# Altium project STM32G4_DRV8301_hardware.PrjPcb (part 1 of 5)
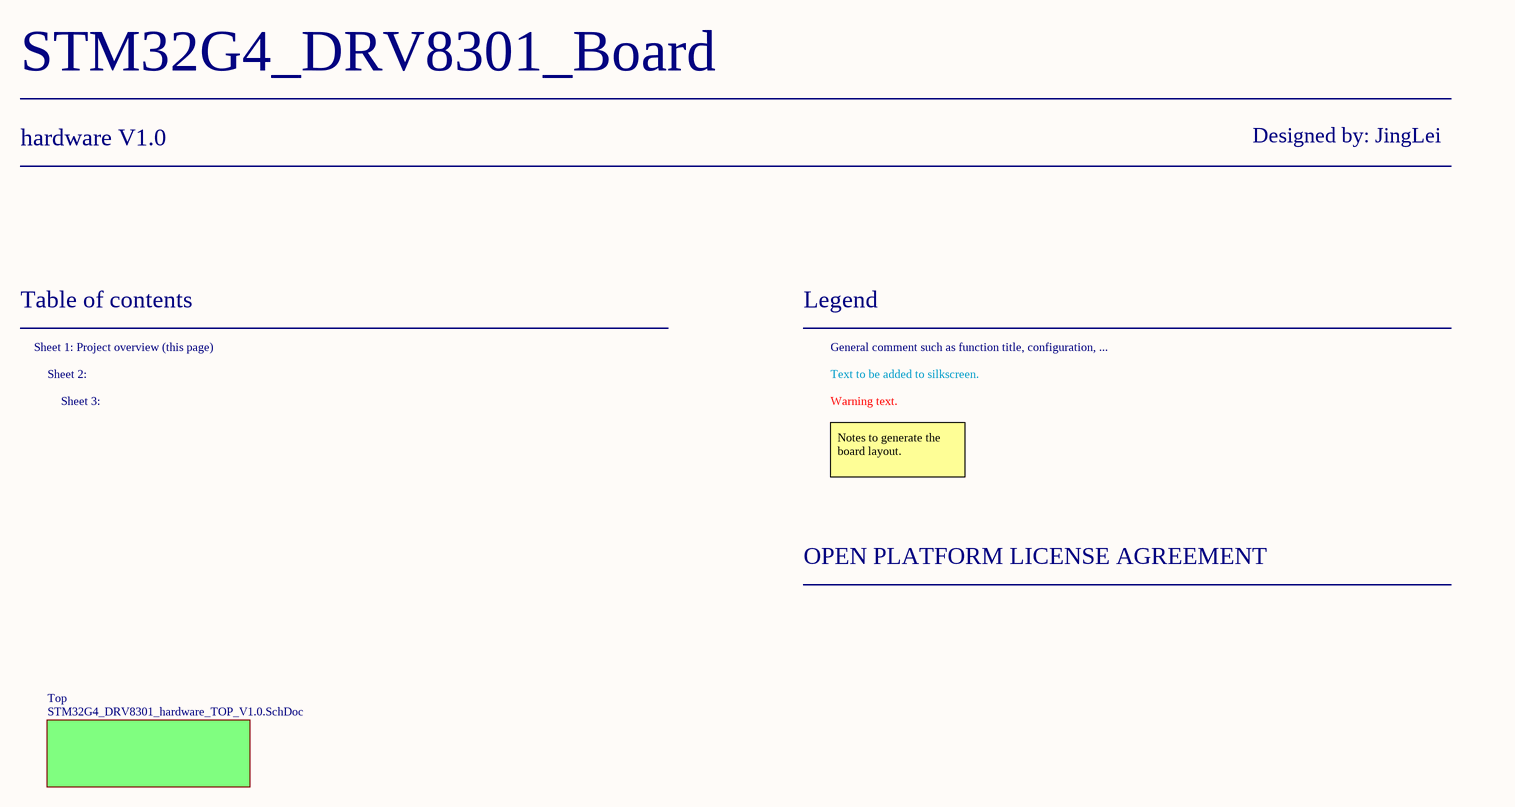
[diagram p0: Project_overview.SchDoc]
9 sheets, 368 parts. Net scope: flat (ports and power ports of the same name join across sheets).
Board file: STM32G4_DRV8301_hardware.PcbDoc
Sheets:
  Project_overview.SchDoc
    Top = STM32G4_DRV8301_hardware_TOP_V1.0.SchDoc
      Designator = STM32G4_microcontroller.SchDoc
      Designator = STM32G4_microcontroller_Power.SchDoc
      Designator = M1_DRV8301_driver.SchDoc
      Designator = DRV8301_inverter.SchDoc
      Designator = STM32F1_microcontroller.SchDoc
      Designator = DRV8301_SENSE.SchDoc
      Designator = M2_DRV8301_driver.SchDoc

## Sheet Project_overview.SchDoc
size 420 x 297 mm; SheetNumber: 1; SheetTotal: 8

### Sub-sheets
Top = STM32G4_DRV8301_hardware_TOP_V1.0.SchDoc: no entries

### Notes on the sheet
- STM32G4_DRV8301_Board
- hardware V1.0
- Designed by: JingLei
- Table of contents
- Sheet 1: Project overview (this page)
- Legend
- General comment such as function title, configuration, ...
- Sheet 2:
- Sheet 3:
- Text to be added to silkscreen.
- Warning text.
- Notes to generate the board layout.
- OPEN PLATFORM LICENSE AGREEMENT
- THIS DOCUMENT AND THE DATA DISCLOSED HEREIN OR
- HEREWITH IS THE PROPERTY OF ALTIUM LIMITED AND MAY
- DWG NO:
- REVISION
- REV:
- DESCRIPTION
- DATE
- APPROVED
- BE FREELY DISTRIBUTED IN WHOLE. NO RIGHTS ARE
- RESERVED OR EXPRESS OR IMPLIED WARANTEE GIVEN.
- ENG:
- APPROVALS
- PROJECT
- DSN:
- CHK:
- REFERENCE DOCUMENTS
- PROJECT REVISION:
- TITLE
- DOCUMENT REVISION:
- DESIGN ITEM:
- BOM:
- FAB DWG:
- PCB DWG:
- ASSY DWG:
- SCALE:
- A3
- SIZE
- CAGE CODE
- FILE NAME
- DWG NO.
- SHEET
- OF
- REV

## Sheet STM32G4_DRV8301_hardware_TOP_V1.0.SchDoc
size 420 x 297 mm; SheetNumber: 2; SheetTotal: 9
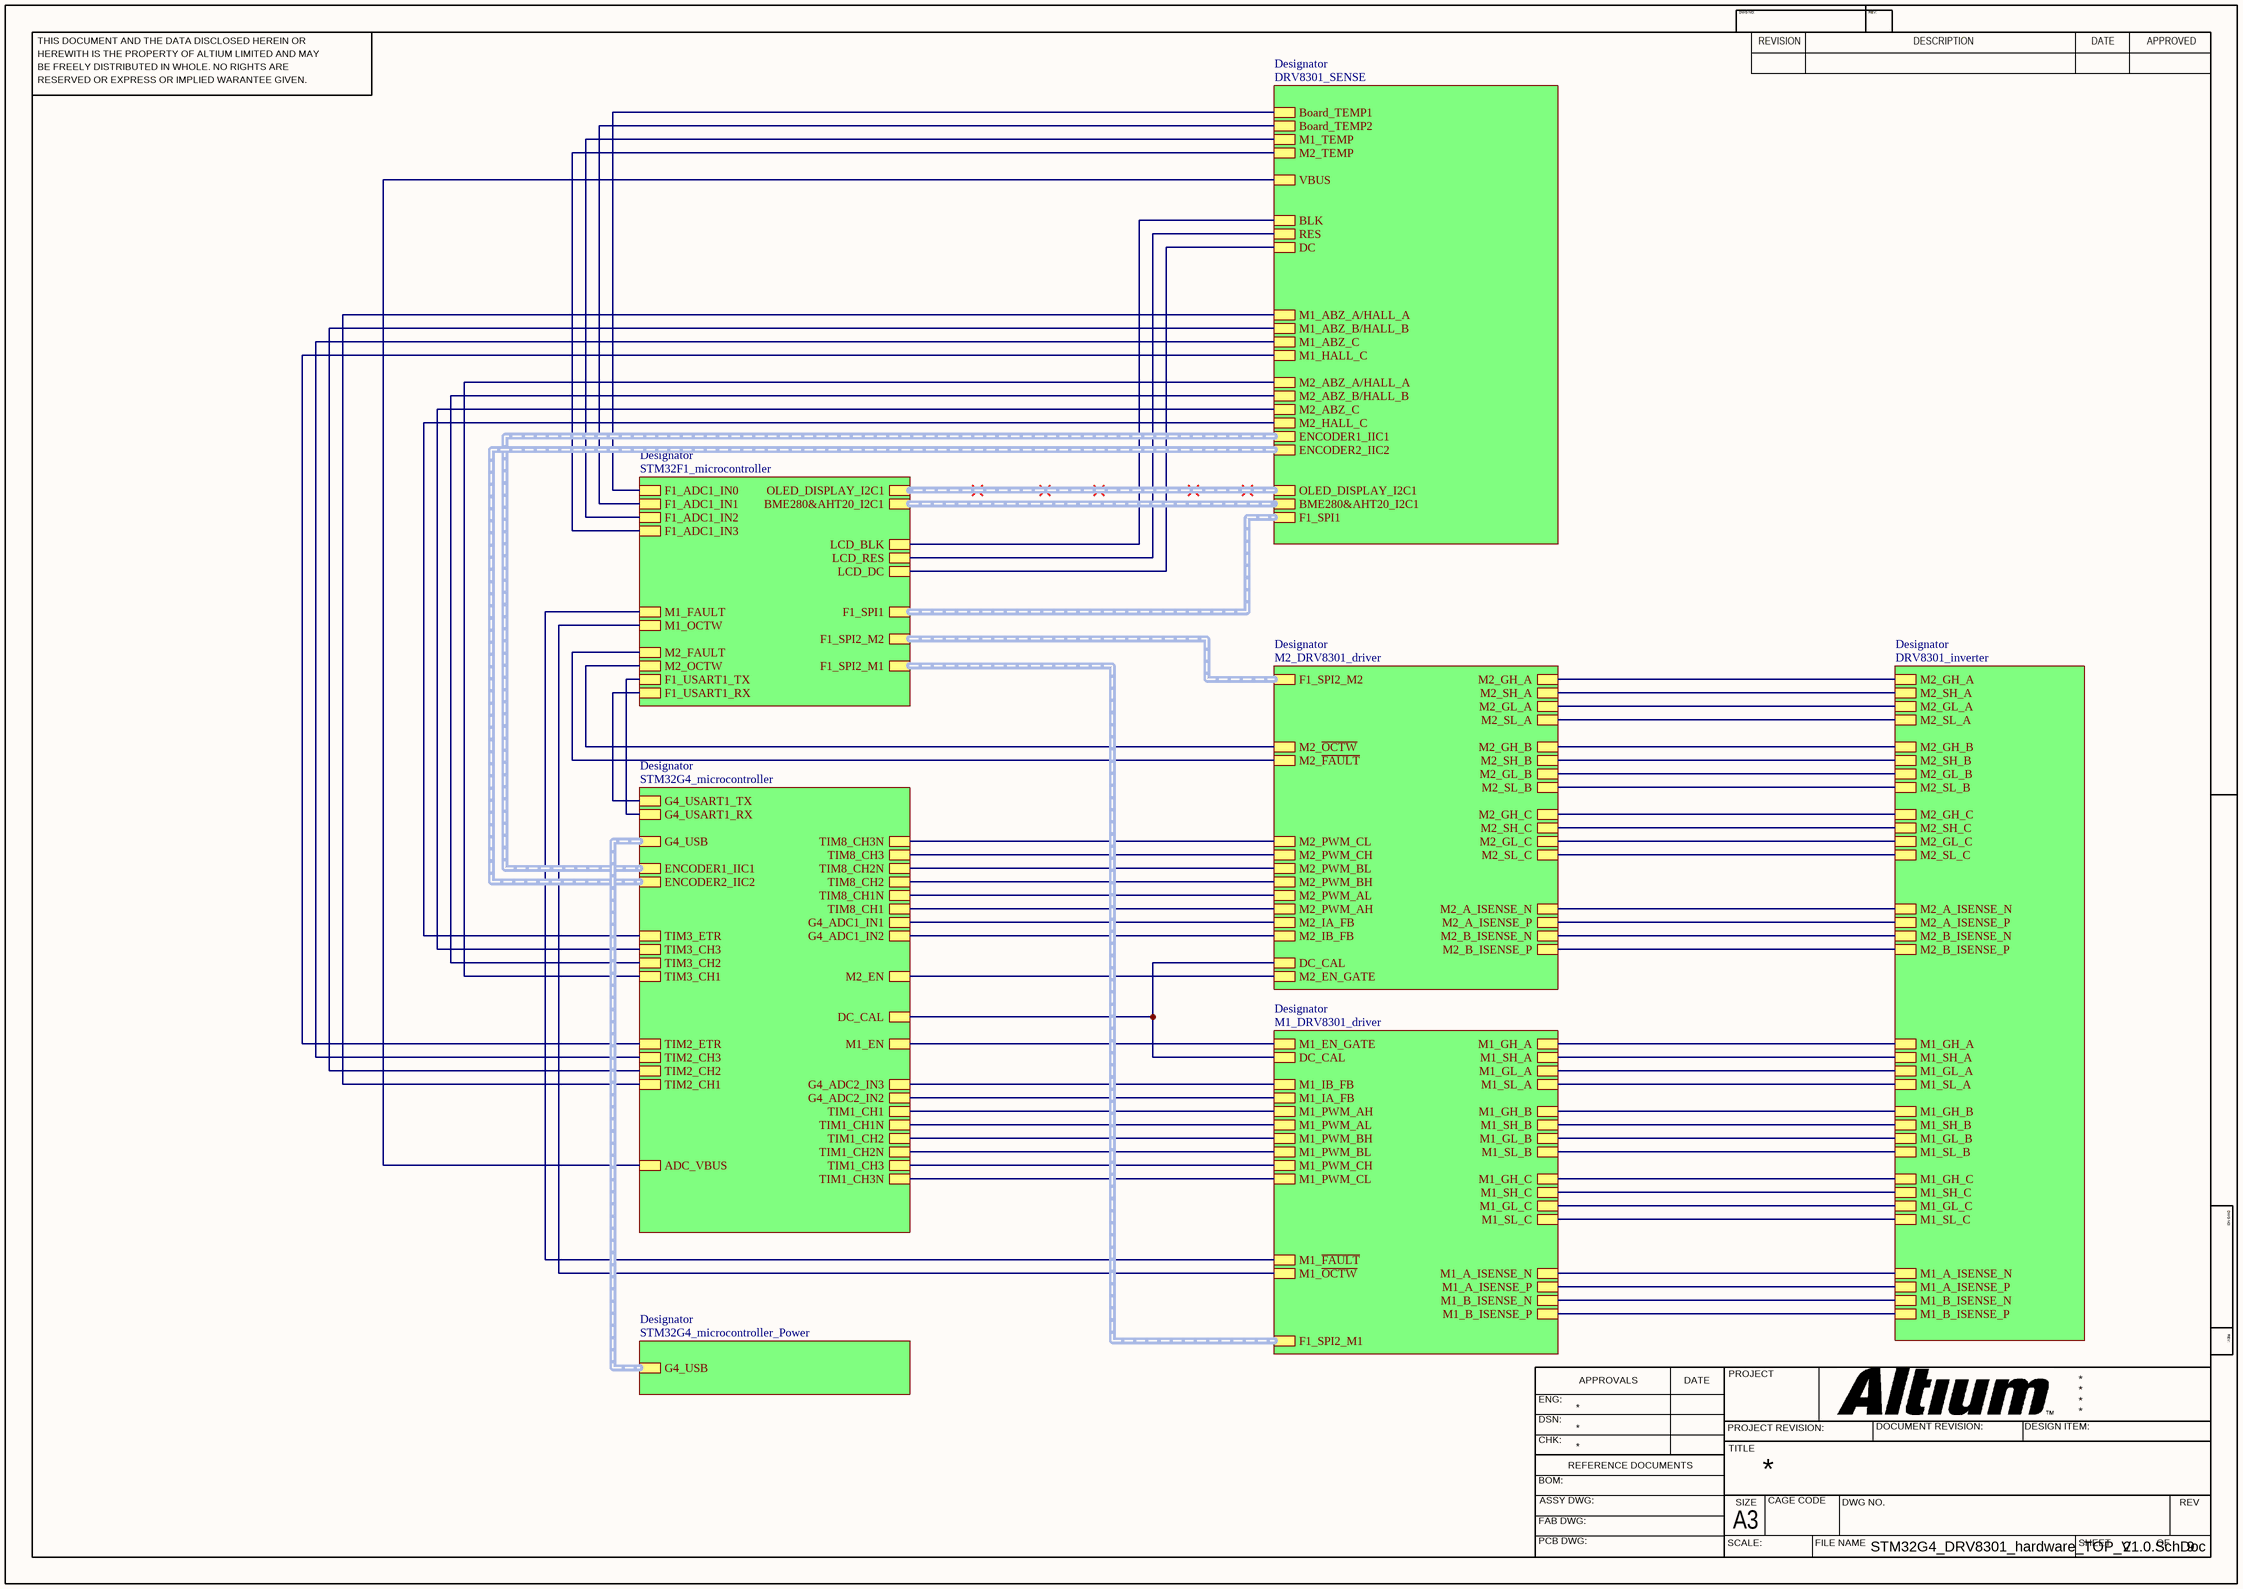
[diagram p1: STM32G4_DRV8301_hardware_TOP_V1.0.SchDoc]

### Sub-sheets
Designator = STM32G4_microcontroller: G4_ADC1_IN1, G4_ADC1_IN2, TIM3_CH2, G4_ADC2_IN3, M2_EN, ADC_VBUS, G4_ADC2_IN2, TIM3_CH1, TIM3_ETR, ENCODER2_IIC2 (harness ENCODER2_IIC2), G4_USB (harness G4_USB), ENCODER1_IIC1 (harness ENCODER1_IIC1), DC_CAL, M1_EN, TIM1_CH1, TIM1_CH2, TIM1_CH3, TIM1_CH1N, TIM1_CH2N, TIM1_CH3N, TIM8_CH1, TIM8_CH2, TIM8_CH3, TIM8_CH1N, TIM8_CH2N, TIM8_CH3N, TIM3_CH3, TIM2_ETR, TIM2_CH1, TIM2_CH2, TIM2_CH3, G4_USART1_TX, G4_USART1_RX
Designator = STM32G4_microcontroller_Power: G4_USB (harness G4_USB)
Designator = M1_DRV8301_driver: M1_PWM_AL, M1_PWM_AH, M1_PWM_BH, M1_PWM_CH, M1_PWM_BL, M1_PWM_CL, M1_~{OCTW}, M1_~{FAULT}, M1_IA_FB, M1_EN_GATE, M1_IB_FB, M1_GH_A, M1_SH_A, M1_GL_A, M1_SL_A, M1_GH_B, M1_SH_B, M1_GL_B, M1_SL_B, M1_GH_C, M1_SH_C, M1_GL_C, M1_SL_C, M1_A_ISENSE_N, M1_A_ISENSE_P, M1_B_ISENSE_N, M1_B_ISENSE_P, DC_CAL, F1_SPI2_M1 (harness F1_SPI2_M1)
Designator = DRV8301_inverter: M2_GH_A, M2_SH_A, M2_GL_A, M2_SL_A, M2_GH_B, M2_SH_B, M2_GL_B, M2_SL_B, M2_GH_C, M2_SH_C, M2_GL_C, M2_SL_C, M2_A_ISENSE_N, M2_A_ISENSE_P, M2_B_ISENSE_N, M2_B_ISENSE_P, M1_GH_A, M1_SH_A, M1_GL_A, M1_SL_A, M1_GH_B, M1_SH_B, M1_GL_B, M1_SL_B, M1_GH_C, M1_SH_C, M1_GL_C, M1_SL_C, M1_A_ISENSE_N, M1_A_ISENSE_P, M1_B_ISENSE_N, M1_B_ISENSE_P
Designator = STM32F1_microcontroller: F1_ADC1_IN0, M2_FAULT, M2_OCTW, M1_FAULT, M1_OCTW, BME280&AHT20_I2C1 (harness BME280&AHT20_I2C1), OLED_DISPLAY_I2C1 (harness OLED_DISPLAY_I2C1), F1_ADC1_IN1, F1_ADC1_IN2, F1_ADC1_IN3, F1_SPI1 (harness F1_SPI1), F1_SPI2_M1 (harness F1_SPI2_M1), F1_SPI2_M2 (harness F1_SPI2_M2), LCD_BLK, LCD_RES, LCD_DC, F1_USART1_TX, F1_USART1_RX
Designator = DRV8301_SENSE: Board_TEMP1, Board_TEMP2, M1_TEMP, M2_TEMP, BLK, DC, RES, OLED_DISPLAY_I2C1 (harness OLED_DISPLAY_I2C1), BME280&AHT20_I2C1 (harness BME280&AHT20_I2C1), F1_SPI1 (harness F1_SPI1), ENCODER2_IIC2 (harness ENCODER2_IIC2), ENCODER1_IIC1 (harness ENCODER1_IIC1), M1_ABZ_A/HALL_A, M1_ABZ_B/HALL_B, M1_HALL_C, M1_ABZ_C, M2_ABZ_A/HALL_A, M2_ABZ_B/HALL_B, M2_HALL_C, M2_ABZ_C, VBUS
Designator = M2_DRV8301_driver: M2_PWM_AL, M2_PWM_AH, M2_PWM_BH, M2_PWM_CH, M2_PWM_BL, M2_PWM_CL, M2_~{OCTW}, M2_~{FAULT}, M2_IA_FB, M2_EN_GATE, M2_IB_FB, M2_GH_A, M2_SH_A, M2_GL_A, M2_SL_A, M2_GH_B, M2_SH_B, M2_GL_B, M2_SL_B, M2_GH_C, M2_SH_C, M2_GL_C, M2_SL_C, M2_A_ISENSE_N, M2_A_ISENSE_P, M2_B_ISENSE_N, M2_B_ISENSE_P, DC_CAL, F1_SPI2_M2 (harness F1_SPI2_M2)

### Nets
(unnamed): sheet Designator/G4_ADC1_IN1, sheet Designator/M2_IA_FB
(unnamed): sheet Designator/G4_ADC1_IN2, sheet Designator/M2_IB_FB
(unnamed): sheet Designator/TIM3_CH2, sheet Designator/M2_ABZ_B/HALL_B
(unnamed): sheet Designator/G4_ADC2_IN3, sheet Designator/M1_IB_FB
(unnamed): sheet Designator/M2_EN, sheet Designator/M2_EN_GATE
(unnamed): sheet Designator/ADC_VBUS, sheet Designator/VBUS
(unnamed): sheet Designator/G4_ADC2_IN2, sheet Designator/M1_IA_FB
(unnamed): sheet Designator/TIM3_CH1, sheet Designator/M2_ABZ_A/HALL_A
(unnamed): sheet Designator/TIM3_ETR, sheet Designator/M2_HALL_C
(unnamed): sheet Designator/DC_CAL, sheet Designator/DC_CAL, sheet Designator/DC_CAL
(unnamed): sheet Designator/M1_EN, sheet Designator/M1_EN_GATE
(unnamed): sheet Designator/TIM1_CH1, sheet Designator/M1_PWM_AH
(unnamed): sheet Designator/TIM1_CH2, sheet Designator/M1_PWM_BH
(unnamed): sheet Designator/TIM1_CH3, sheet Designator/M1_PWM_CH
(unnamed): sheet Designator/TIM1_CH1N, sheet Designator/M1_PWM_AL
(unnamed): sheet Designator/TIM1_CH2N, sheet Designator/M1_PWM_BL
(unnamed): sheet Designator/TIM1_CH3N, sheet Designator/M1_PWM_CL
(unnamed): sheet Designator/TIM8_CH1, sheet Designator/M2_PWM_AH
(unnamed): sheet Designator/TIM8_CH2, sheet Designator/M2_PWM_BH
(unnamed): sheet Designator/TIM8_CH3, sheet Designator/M2_PWM_CH
(unnamed): sheet Designator/TIM8_CH1N, sheet Designator/M2_PWM_AL
(unnamed): sheet Designator/TIM8_CH2N, sheet Designator/M2_PWM_BL
(unnamed): sheet Designator/TIM8_CH3N, sheet Designator/M2_PWM_CL
(unnamed): sheet Designator/TIM3_CH3, sheet Designator/M2_ABZ_C
(unnamed): sheet Designator/TIM2_ETR, sheet Designator/M1_HALL_C
(unnamed): sheet Designator/TIM2_CH1, sheet Designator/M1_ABZ_A/HALL_A
(unnamed): sheet Designator/TIM2_CH2, sheet Designator/M1_ABZ_B/HALL_B
(unnamed): sheet Designator/TIM2_CH3, sheet Designator/M1_ABZ_C
(unnamed): sheet Designator/G4_USART1_TX, sheet Designator/F1_USART1_RX
(unnamed): sheet Designator/G4_USART1_RX, sheet Designator/F1_USART1_TX
(unnamed): sheet Designator/M1_~{OCTW}, sheet Designator/M1_OCTW
(unnamed): sheet Designator/M1_~{FAULT}, sheet Designator/M1_FAULT
(unnamed): sheet Designator/M1_GH_A, sheet Designator/M1_GH_A
(unnamed): sheet Designator/M1_SH_A, sheet Designator/M1_SH_A
(unnamed): sheet Designator/M1_GL_A, sheet Designator/M1_GL_A
(unnamed): sheet Designator/M1_SL_A, sheet Designator/M1_SL_A
(unnamed): sheet Designator/M1_GH_B, sheet Designator/M1_GH_B
(unnamed): sheet Designator/M1_SH_B, sheet Designator/M1_SH_B
(unnamed): sheet Designator/M1_GL_B, sheet Designator/M1_GL_B
(unnamed): sheet Designator/M1_SL_B, sheet Designator/M1_SL_B
(unnamed): sheet Designator/M1_GH_C, sheet Designator/M1_GH_C
(unnamed): sheet Designator/M1_SH_C, sheet Designator/M1_SH_C
(unnamed): sheet Designator/M1_GL_C, sheet Designator/M1_GL_C
(unnamed): sheet Designator/M1_SL_C, sheet Designator/M1_SL_C
(unnamed): sheet Designator/M1_A_ISENSE_N, sheet Designator/M1_A_ISENSE_N
(unnamed): sheet Designator/M1_A_ISENSE_P, sheet Designator/M1_A_ISENSE_P
(unnamed): sheet Designator/M1_B_ISENSE_N, sheet Designator/M1_B_ISENSE_N
(unnamed): sheet Designator/M1_B_ISENSE_P, sheet Designator/M1_B_ISENSE_P
(unnamed): sheet Designator/M2_GH_A, sheet Designator/M2_GH_A
(unnamed): sheet Designator/M2_SH_A, sheet Designator/M2_SH_A
(unnamed): sheet Designator/M2_GL_A, sheet Designator/M2_GL_A
(unnamed): sheet Designator/M2_SL_A, sheet Designator/M2_SL_A
(unnamed): sheet Designator/M2_GH_B, sheet Designator/M2_GH_B
(unnamed): sheet Designator/M2_SH_B, sheet Designator/M2_SH_B
(unnamed): sheet Designator/M2_GL_B, sheet Designator/M2_GL_B
(unnamed): sheet Designator/M2_SL_B, sheet Designator/M2_SL_B
(unnamed): sheet Designator/M2_GH_C, sheet Designator/M2_GH_C
(unnamed): sheet Designator/M2_SH_C, sheet Designator/M2_SH_C
(unnamed): sheet Designator/M2_GL_C, sheet Designator/M2_GL_C
(unnamed): sheet Designator/M2_SL_C, sheet Designator/M2_SL_C
(unnamed): sheet Designator/M2_A_ISENSE_N, sheet Designator/M2_A_ISENSE_N
(unnamed): sheet Designator/M2_A_ISENSE_P, sheet Designator/M2_A_ISENSE_P
(unnamed): sheet Designator/M2_B_ISENSE_N, sheet Designator/M2_B_ISENSE_N
(unnamed): sheet Designator/M2_B_ISENSE_P, sheet Designator/M2_B_ISENSE_P
(unnamed): sheet Designator/F1_ADC1_IN0, sheet Designator/Board_TEMP1
(unnamed): sheet Designator/M2_FAULT, sheet Designator/M2_~{FAULT}
(unnamed): sheet Designator/M2_OCTW, sheet Designator/M2_~{OCTW}
(unnamed): sheet Designator/F1_ADC1_IN1, sheet Designator/Board_TEMP2
(unnamed): sheet Designator/F1_ADC1_IN2, sheet Designator/M1_TEMP
(unnamed): sheet Designator/F1_ADC1_IN3, sheet Designator/M2_TEMP
(unnamed): sheet Designator/LCD_BLK, sheet Designator/BLK
(unnamed): sheet Designator/LCD_RES, sheet Designator/RES
(unnamed): sheet Designator/LCD_DC, sheet Designator/DC

### Notes on the sheet
- THIS DOCUMENT AND THE DATA DISCLOSED HEREIN OR
- HEREWITH IS THE PROPERTY OF ALTIUM LIMITED AND MAY
- DWG NO:
- REVISION
- REV:
- DESCRIPTION
- DATE
- APPROVED
- BE FREELY DISTRIBUTED IN WHOLE. NO RIGHTS ARE
- RESERVED OR EXPRESS OR IMPLIED WARANTEE GIVEN.
- ENG:
- APPROVALS
- PROJECT
- DSN:
- CHK:
- REFERENCE DOCUMENTS
- PROJECT REVISION:
- TITLE
- DOCUMENT REVISION:
- DESIGN ITEM:
- BOM:
- FAB DWG:
- PCB DWG:
- ASSY DWG:
- SCALE:
- A3
- SIZE
- CAGE CODE
- FILE NAME
- DWG NO.
- SHEET
- OF
- REV

## Sheet STM32G4_microcontroller.SchDoc
size 420 x 297 mm; SheetNumber: 3; SheetTotal: 9
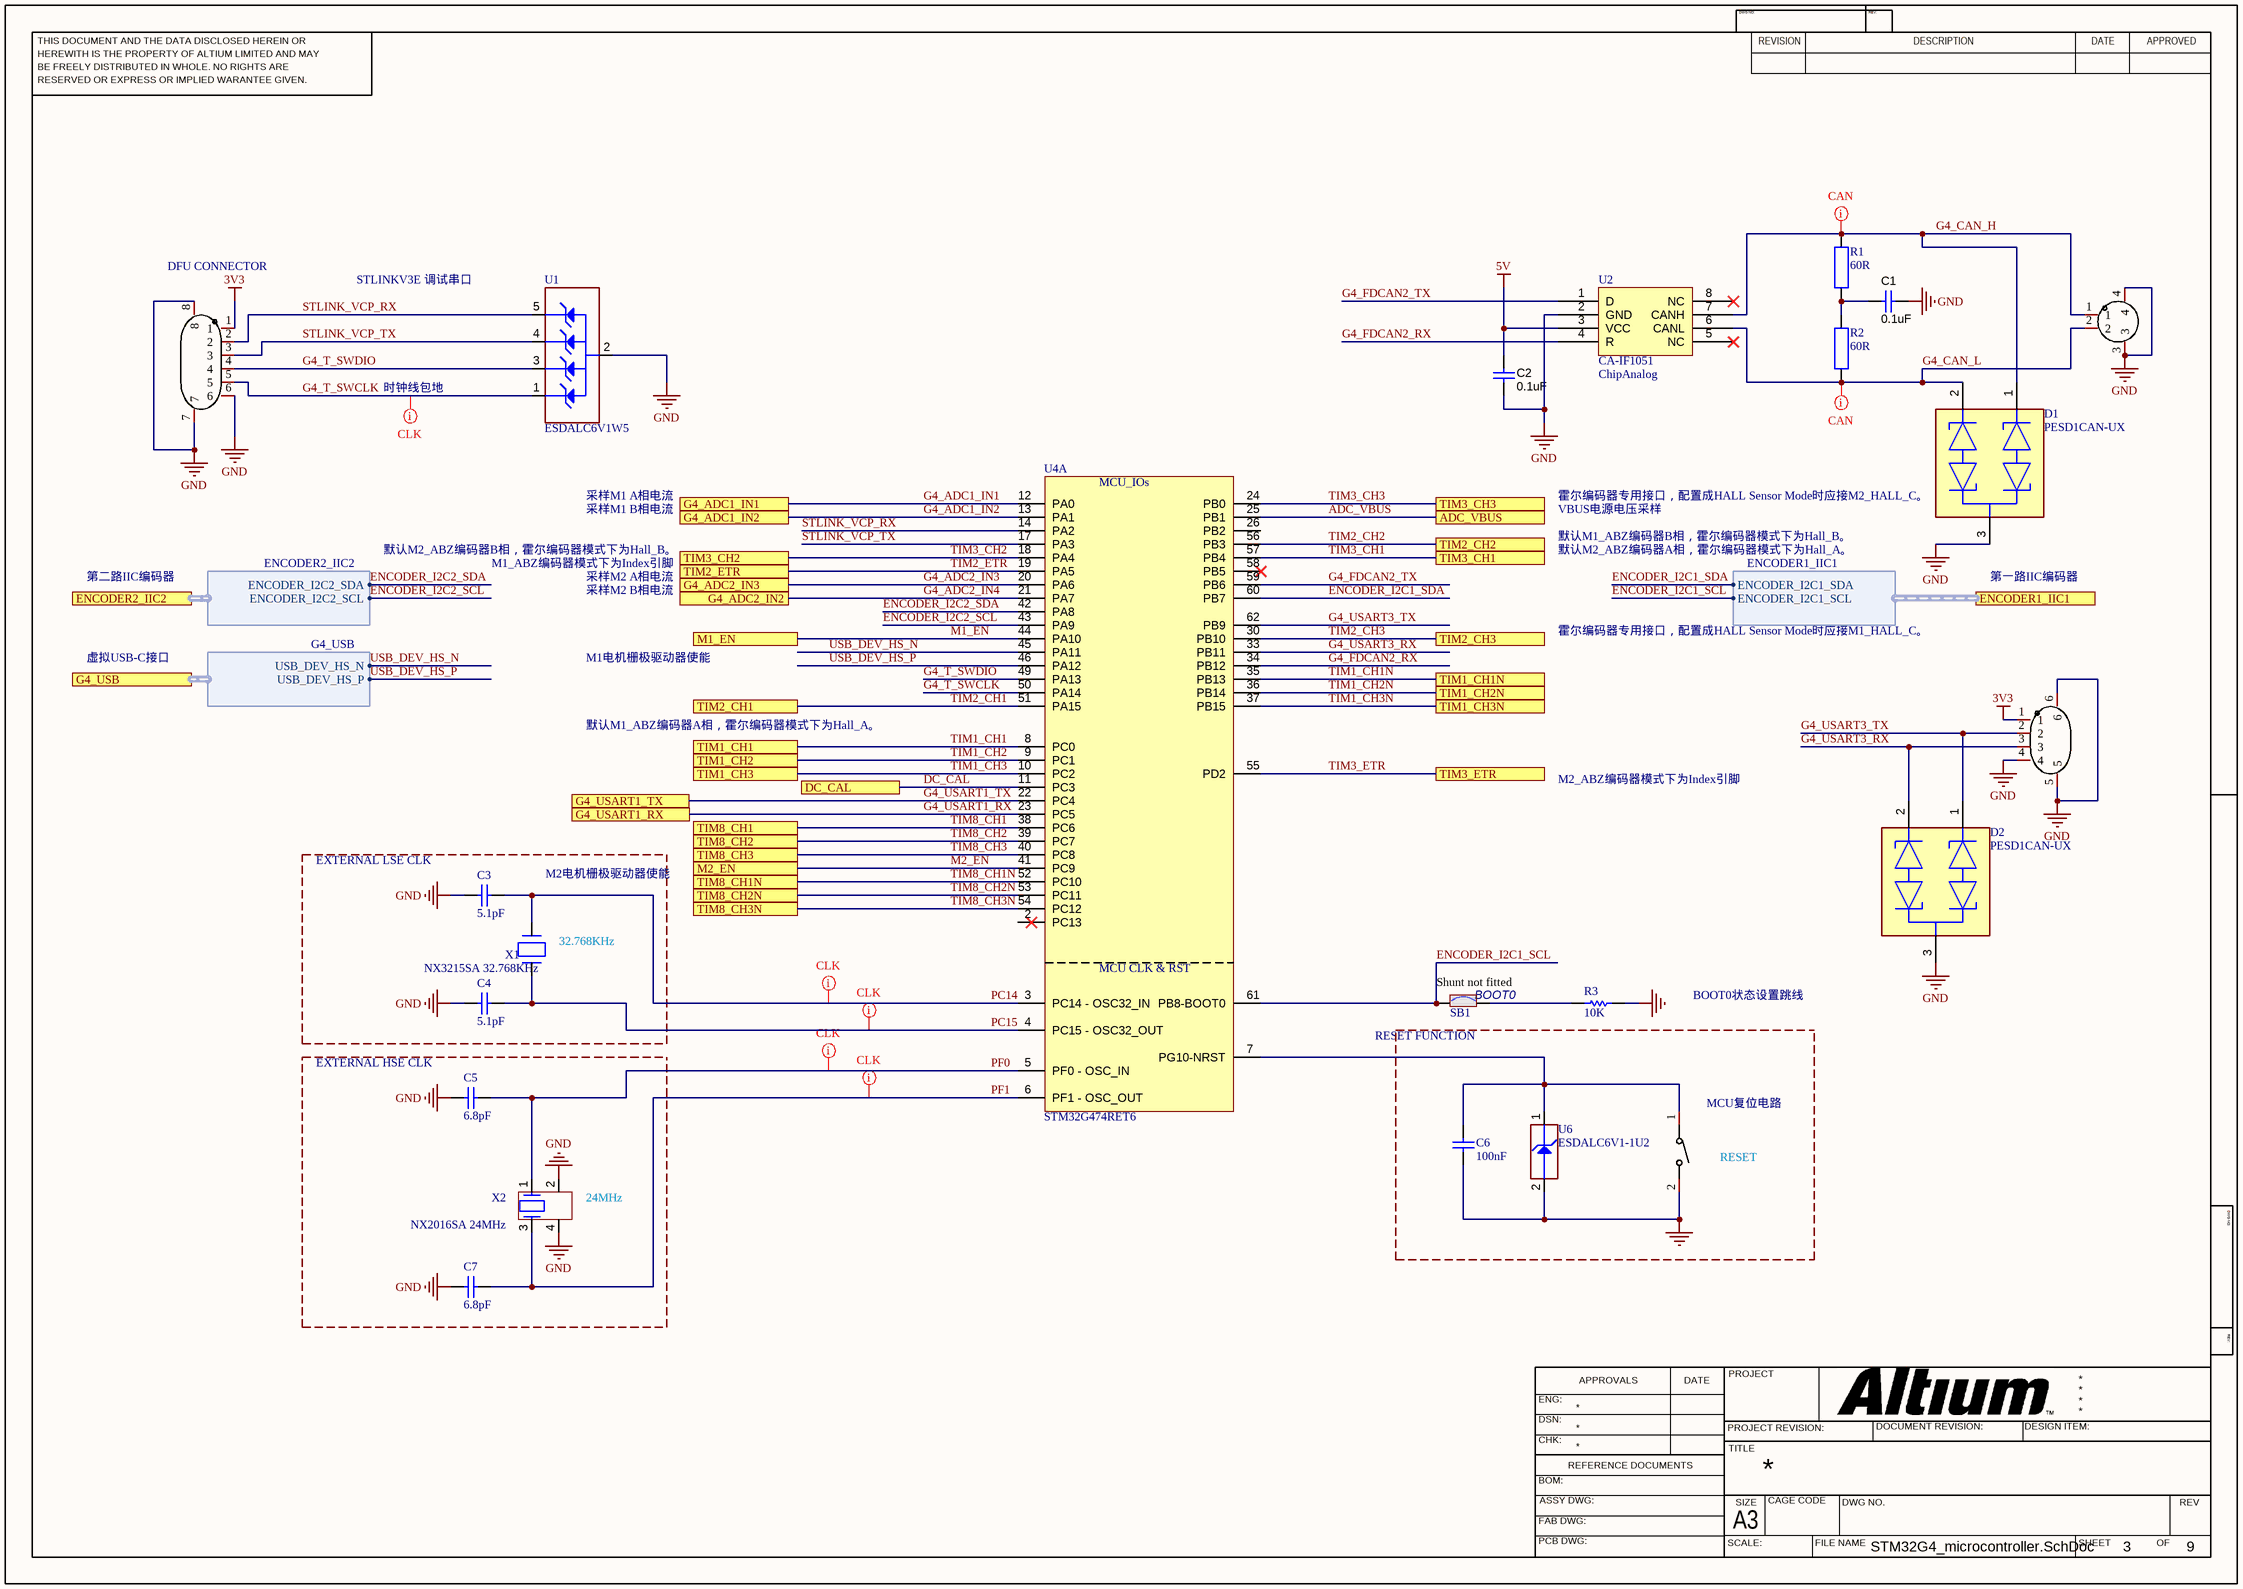
[diagram p2: STM32G4_microcontroller.SchDoc]

### Parts
C1  ValueDisplayed: 0.1uF  [0603L]  (hidden comment: GRM188R61E105KA12D)
C2  ValueDisplayed: 0.1uF  [0603L]  (hidden comment: GRM188R61E105KA12D)
C3  value 5.1pF  [C0402]
C4  value 5.1pF  [C0402]
C5  value 6.8pF  [C0402]
C6  value 100nF  [C0402]
C7  value 6.8pF  [C0402]
CN1  WAFER-GH1.25-2PWB  [CONN-TH_2P-P1.25_XUNPU_WAFER-GH1.25-2PWB]  (value not drawn)
D1  PESD1CAN-UX  [FP-SOT323-MFG]
D2  PESD1CAN-UX  [FP-SOT323-MFG]
R1  60R  [RESC1608X55N]
R2  60R  [RESC1608X55N]
R3  value 10K  [R0603]
SB1  MCD-00071  [SOLDER-BRIDGE_R0603-0R]  (value not drawn)
SW1  TS-1088-AR02016  [SW-SMD_L3.9-W3.0-P4.45]  (value not drawn)
U1  value ESDALC6V1W5  [ESD_SOT323-5L]
U2  CA-IF1051  [SOIC127P600X175-8N]
U3  WAFER-GH1.25-6PWB  [CONN-SMD_6P-P1.25_XUNPU_WAFER-GH1.25-6PWB]  (value not drawn)
U4  value STM32G474RET6  [ICC_LQFP64_10X10_P050_SOCKET_YAMAICHI_IC149-064-069-B5_NM]  (part A of 2)
U5  WAFER-GH1.25-4PWB  [CONN-SMD_4P-P1.25_XUNPU_WAFER-GH1.25-4PWB]  (value not drawn)
U6  value ESDALC6V1-1U2  [ESD_ST0201]
X1  value NX3215SA 32.768KHz  [CRY_NX3215SA_2P]
X2  value NX2016SA 24MHz  [CRY_NX2016SA_4P]

### Ports
ADC_VBUS (see STM32G4_DRV8301_hardware_TOP_V1.0[2C]), DC_CAL (see STM32G4_DRV8301_hardware_TOP_V1.0[3C], M1_DRV8301_driver[7D], M2_DRV8301_driver[8D]), ENCODER1_IIC1 (harness ENCODER1_IIC1, see STM32G4_DRV8301_hardware_TOP_V1.0[2C], DRV8301_SENSE[3E]), ENCODER2_IIC2 (harness ENCODER2_IIC2, see STM32G4_DRV8301_hardware_TOP_V1.0[2C], DRV8301_SENSE[3E]), G4_ADC1_IN1 (see STM32G4_DRV8301_hardware_TOP_V1.0[3C]), G4_ADC1_IN2 (see STM32G4_DRV8301_hardware_TOP_V1.0[3C]), G4_ADC2_IN2 (see STM32G4_DRV8301_hardware_TOP_V1.0[3C]), G4_ADC2_IN3 (see STM32G4_DRV8301_hardware_TOP_V1.0[3C]), G4_USART1_RX (see STM32G4_DRV8301_hardware_TOP_V1.0[2C]), G4_USART1_TX (see STM32G4_DRV8301_hardware_TOP_V1.0[2C]), G4_USB (harness G4_USB, see STM32G4_DRV8301_hardware_TOP_V1.0[2C], STM32G4_microcontroller_Power[3D]), M1_EN (see STM32G4_DRV8301_hardware_TOP_V1.0[3C]), M2_EN (see STM32G4_DRV8301_hardware_TOP_V1.0[3C]), TIM1_CH1 (see STM32G4_DRV8301_hardware_TOP_V1.0[3C]), TIM1_CH1N (see STM32G4_DRV8301_hardware_TOP_V1.0[3C]), TIM1_CH2 (see STM32G4_DRV8301_hardware_TOP_V1.0[3C]), TIM1_CH2N (see STM32G4_DRV8301_hardware_TOP_V1.0[3C]), TIM1_CH3 (see STM32G4_DRV8301_hardware_TOP_V1.0[3C]), TIM1_CH3N (see STM32G4_DRV8301_hardware_TOP_V1.0[3C]), TIM2_CH1 (see STM32G4_DRV8301_hardware_TOP_V1.0[2C]), TIM2_CH2 (see STM32G4_DRV8301_hardware_TOP_V1.0[2C]), TIM2_CH3 (see STM32G4_DRV8301_hardware_TOP_V1.0[2C]), TIM2_ETR (see STM32G4_DRV8301_hardware_TOP_V1.0[2C]), TIM3_CH1 (see STM32G4_DRV8301_hardware_TOP_V1.0[2C]), TIM3_CH2 (see STM32G4_DRV8301_hardware_TOP_V1.0[2C]), TIM3_CH3 (see STM32G4_DRV8301_hardware_TOP_V1.0[2C]), TIM3_ETR (see STM32G4_DRV8301_hardware_TOP_V1.0[2C]), TIM8_CH1 (see STM32G4_DRV8301_hardware_TOP_V1.0[3C]), TIM8_CH1N (see STM32G4_DRV8301_hardware_TOP_V1.0[3C]), TIM8_CH2 (see STM32G4_DRV8301_hardware_TOP_V1.0[3C]), TIM8_CH2N (see STM32G4_DRV8301_hardware_TOP_V1.0[3C]), TIM8_CH3 (see STM32G4_DRV8301_hardware_TOP_V1.0[3C]), TIM8_CH3N (see STM32G4_DRV8301_hardware_TOP_V1.0[3C])

### Harnesses
ENCODER2_IIC2: ENCODER_I2C2_SDA, ENCODER_I2C2_SCL
G4_USB: USB_DEV_HS_N, USB_DEV_HS_P
ENCODER1_IIC1: ENCODER_I2C1_SDA, ENCODER_I2C1_SCL

### Nets
3V3: U3.1 U5.1
5V: C2.1 U2.3(VCC)
GND: C1.2 C2.2 C3.2 C4.2 C5.1 C6.1 C7.1 CN1.3 CN1.4 D1.3(common_cathode) D2.3(common_cathode) R3.1 SW1.2 U1.2(GND) U2.2(GND) U3.6 U3.7 U3.8 U5.4 U5.5 U5.6 U6.2(GND) X2.2 X2.4
ADC_VBUS: U4.25(PB1) ; port ADC_VBUS
DC_CAL: U4.11(PC3) ; port DC_CAL
ENCODER_I2C1_SCL: SB1.1 U4.61(PB8-BOOT0) ; port ENCODER1_IIC1.ENCODER_I2C1_SCL
ENCODER_I2C1_SDA: U4.60(PB7) ; port ENCODER1_IIC1.ENCODER_I2C1_SDA
ENCODER_I2C2_SCL: U4.43(PA9) ; port ENCODER2_IIC2.ENCODER_I2C2_SCL
ENCODER_I2C2_SDA: U4.42(PA8) ; port ENCODER2_IIC2.ENCODER_I2C2_SDA
G4_ADC1_IN1: U4.12(PA0) ; port G4_ADC1_IN1
G4_ADC1_IN2: U4.13(PA1) ; port G4_ADC1_IN2
G4_ADC2_IN3: U4.20(PA6) ; port G4_ADC2_IN3
G4_ADC2_IN4: U4.21(PA7) ; port G4_ADC2_IN2
G4_CAN_H: CN1.1 D1.1(cathode_1) R1.2 U2.7(CANH)
G4_CAN_L: CN1.2 D1.2(cathode_2) R2.1 U2.6(CANL)
G4_FDCAN2_RX: U2.4(R) U4.34(PB12)
G4_FDCAN2_TX: U2.1(D) U4.59(PB6)
G4_T_SWCLK: U1.1(IO1) U3.5 U4.50(PA14)
G4_T_SWDIO: U1.3(IO2) U3.4 U4.49(PA13)
G4_USART1_RX: U4.23(PC5) ; port G4_USART1_RX
G4_USART1_TX: U4.22(PC4) ; port G4_USART1_TX
G4_USART3_RX: D2.2(cathode_2) U4.33(PB11) U5.3
G4_USART3_TX: D2.1(cathode_1) U4.62(PB9) U5.2
M1_EN: U4.44(PA10) ; port M1_EN
M2_EN: U4.41(PC9) ; port M2_EN
PC14: C3.1 U4.3(PC14_-_OSC32_IN) X1.2(X2)
PC15: C4.1 U4.4(PC15_-_OSC32_OUT) X1.1(X1)
PF0: C5.2 U4.5(PF0_-_OSC_IN) X2.1
PF1: C7.2 U4.6(PF1_-_OSC_OUT) X2.3
STLINK_VCP_RX: U1.5(IO4) U3.2 U4.14(PA2)
STLINK_VCP_TX: U1.4(IO3) U3.3 U4.17(PA3)
TIM1_CH1: U4.8(PC0) ; port TIM1_CH1
TIM1_CH1N: U4.35(PB13) ; port TIM1_CH1N
TIM1_CH2: U4.9(PC1) ; port TIM1_CH2
TIM1_CH2N: U4.36(PB14) ; port TIM1_CH2N
TIM1_CH3: U4.10(PC2) ; port TIM1_CH3
TIM1_CH3N: U4.37(PB15) ; port TIM1_CH3N
TIM2_CH1: U4.51(PA15) ; port TIM2_CH1
TIM2_CH2: U4.56(PB3) ; port TIM2_CH2
TIM2_CH3: U4.30(PB10) ; port TIM2_CH3
TIM2_ETR: U4.19(PA5) ; port TIM2_ETR
TIM3_CH1: U4.57(PB4) ; port TIM3_CH1
TIM3_CH2: U4.18(PA4) ; port TIM3_CH2
TIM3_CH3: U4.24(PB0) ; port TIM3_CH3
TIM3_ETR: U4.55(PD2) ; port TIM3_ETR
TIM8_CH1: U4.38(PC6) ; port TIM8_CH1
TIM8_CH1N: U4.52(PC10) ; port TIM8_CH1N
TIM8_CH2: U4.39(PC7) ; port TIM8_CH2
TIM8_CH2N: U4.53(PC11) ; port TIM8_CH2N
TIM8_CH3: U4.40(PC8) ; port TIM8_CH3
TIM8_CH3N: U4.54(PC12) ; port TIM8_CH3N
USB_DEV_HS_N: U4.45(PA11) ; port G4_USB.USB_DEV_HS_N
USB_DEV_HS_P: U4.46(PA12) ; port G4_USB.USB_DEV_HS_P
NetC1_1: C1.1 R1.1 R2.2
NetC6_2: C6.2 SW1.1 U4.7(PG10-NRST) U6.1(IO1)
NetR3_2: R3.2 SB1.2

Not connected (* = marked no-connect by the designer): U2 5(NC)* 8(NC)*; U4 2(PC13) 26(PB2) 58(PB5)*

### Layout directives
mark named CAN: G4_CAN_H, G4_CAN_L
mark named CLK: G4_T_SWCLK, PC14, PC15, PF0, PF1

### Notes on the sheet
- (near U3) DFU CONNECTOR
- STLINKV3E 调试串口
- 时钟线包地
- (near U2) ChipAnalog
- 采样M1 A相电流
- 采样M1 B相电流
- VBUS电源电压采样
- 霍尔编码器专用接口，配置成HALL Sensor Mode时应接M2_HALL_C。
- 第二路IIC编码器
- 默认M2_ABZ编码器B相，霍尔编码器模式下为Hall_B。
- M1_ABZ编码器模式下为Index引脚
- 采样M2 A相电流
- 采样M2 B相电流
- 默认M1_ABZ编码器B相，霍尔编码器模式下为Hall_B。
- 默认M2_ABZ编码器A相，霍尔编码器模式下为Hall_A。
- 第一路IIC编码器
- 虚拟USB-C接口
- M1电机栅极驱动器使能
- 霍尔编码器专用接口，配置成HALL Sensor Mode时应接M1_HALL_C。
- 默认M1_ABZ编码器A相，霍尔编码器模式下为Hall_A。
- M2_ABZ编码器模式下为Index引脚
- EXTERNAL LSE CLK
- M2电机栅极驱动器使能
- (near X1) 32.768KHz
- (near SB1) Shunt not fitted
- BOOT0
- BOOT0状态设置跳线
- EXTERNAL HSE CLK
- RESET FUNCTION
- (near SW1) MCU复位电路
- (near X2) 24MHz
- (near SW1) RESET
- THIS DOCUMENT AND THE DATA DISCLOSED HEREIN OR
- HEREWITH IS THE PROPERTY OF ALTIUM LIMITED AND MAY
- DWG NO:
- REVISION
- REV:
- DESCRIPTION
- DATE
- APPROVED
- BE FREELY DISTRIBUTED IN WHOLE. NO RIGHTS ARE
- RESERVED OR EXPRESS OR IMPLIED WARANTEE GIVEN.
- ENG:
- APPROVALS
- PROJECT
- DSN:
- CHK:
- REFERENCE DOCUMENTS
- PROJECT REVISION:
- TITLE
- DOCUMENT REVISION:
- DESIGN ITEM:
- BOM:
- FAB DWG:
- PCB DWG:
- ASSY DWG:
- SCALE:
- A3
- SIZE
- CAGE CODE
- FILE NAME
- DWG NO.
- SHEET
- OF
- REV
- (in symbol MCD-01243, part A) MCU_IOs; MCU CLK & RST

### Library data of the parts
C1 C2 = GRM188R61E105KA12D: CAP, CERM, 0.1uF, 25V, +/-10%, X5R, 0603; Manufacturer: MuRata; Polarized: N; CompType: Capacitor; Value: 1uF; U/M: EA; Cap_F: 0.000001; Tolerance_%: 10; Value1: Unknown; VDC_V: 25; TaMin_C: -55; TaMax_C: 85; Cap_Case: 0603; SymbolVersion: 2008-07-09; PartNumber: GRM188R61E105KA12D; PackageReference: 0603; RoHS: Y; Value2: 25V; MountType: SMT; Technology: Ceramic; TempCo: X5R; Published: 2008-06-19; Publisher: Texas Instruments; LatestRevisionDate: 2013-05-24; LatestRevisionNote: Changed publisher; ComponentLink1Description: Datasheet link; ComponentLink1URL: http://search.murata.co.jp/Ceramy/PnsearchViewAction.do?HnOFG=ON&HnNFG=ON&SEL_CNT=50&sLang=en&sKey=GRM188R61E105KA12D&x=9&y=9&search=startwith; Supplier 1: Digi-Key; Supplier Part Number 1: 490-3897-1-ND; Supplier 2: Mouser; Supplier Part Number 2: 81-GRM188R61E105KA12; Supplier 3: Farnell; Supplier Part Number 3: 1828802
C3 C4 = MCD-00003: Capacitor, MLCC, 5.1pF, 50V, NPO, +-0.25pF, 0402, T=0.5mm; Manufacturer_Part_Number: CC0402CRNPO9BN5R1; Manufacturer: YAGEO; ECCN_US: EAR99; ECCN_EU: NEC; Provided_By: SUBCO; Internal_Part_Number: MCD-00003; ComponentLink1Description: Datasheet; Status: Released; Part_Type: Capacitor; Package: C0402; ComponentLink1URL: http://tunmcdsvn.tun.st.com/Component_Datasheet_Library/Trunk/Capacitors/Yageo_Capacitor_NP0_16V-to-50V
C5 C7 = MCD-00674: Capacitor, MLCC, 6.8pF, 50V, NPO, +-0.25pF, 0402, T=0.5mm; Manufacturer_Part_Number: CC0402CRNPO9BN6R8; Manufacturer: YAGEO; Provided_By: SUBCO; Internal_Part_Number: MCD-00674; Status: Released; Part_Type: Capacitor; Package: C0402; ComponentLink1Description: Datasheet; ComponentLink1URL: http://tunmcdsvn.tun.st.com/Component_Datasheet_Library/Trunk/Capacitors/Yageo_Capacitor_NP0_16V-to-50V; ECCN_US: N/A; ECCN_EU: N/A
C6 = MCD-00102: Capacitor, MLCC, 100nF, 16V, X7R, 10%, 0402, T=0,5mm; Manufacturer_Part_Number: CC0402KRX7R7BB104; Manufacturer: YAGEO; Provided_By: Subcon; Initial_Board_Reference: MB1262; Internal_Part_Number: MCD-00102; Status: Released; Package: C0402; ComponentLink1Description: Yageo_Capacitor_X7R-series.pdf; ECCN_US: n/a; ECCN_EU: n/a; Part_Type: Capacitor; ComponentLink1URL: http://tunmcdsvn.tun.st.com/Component_Datasheet_Library/Trunk/Capacitors/Yageo_Multilayer_Capacitor_X7R_series_100pF_to_22uF
CN1 = WAFER-GH1.25-2PWB: Manufacturer: XUNPU(讯普); Add into BOM: yes; Pins Structure: 1x2P; Pitch: 1.25mm; Reference Series: GH; Number of PINs Per Row: 2; Current Rating (Max): 1A; Symbol: WAFER-GH1.25-2PWB; Device: WAFER-GH1.25-2PWB; LCSC Part Name: 1x2P 间距:1.25mm 卧贴 系列:GH; Supplier Part: C3029377; Manufacturer Part: WAFER-GH1.25-2PWB; Supplier Footprint: SMD,P=1.25mm,卧贴; JLCPCB Part Class: Extended Part; Datasheet: https://atta.szlcsc.com/upload/public/pdf/source/20220527/CB8773BFB0913C3B8ABD62CB38BA101A.pdf; Supplier: LCSC; Convert to PCB: yes; Mounting Style: 卧贴; Number of Pins: 2P; Number of Rows: 1; Operating Temperature Range: -25℃~+85℃
D1 D2 = CMP-14436-000006-1: TVS DIODE 24V 50V SC70-3
R1 R2 = RC0603FR-07120RL: RES SMD 60 OHM 1% 1/10W 0603; Manufacturer: Yageo; Resistance (Ohms): 120; Power (Watts): 0.1W, 1/10W; Temperature Coefficient: ±100ppm/°C; Supplier 1: Digi-Key; Supplier Part Number 1: 311-120HRCT-ND; Manufacturer Part Number: RC0603FR-07120RL; RoHS: RoHS Compliant; Category: Resistors; Stock 1: 1545282; Pricing 1: 1=0.1, 10=0.014, 25=0.01, 100=0.0057, 250=0.00436, 500=0.00348, 1000=0.00257, 2500=0.00223 (USD); Packaging: Cut Tape (CT); Tolerance: ±1%; Composition: Thick Film; Features: Moisture Resistant; Operating Temperature: -55°C ~ 155°C; Package / Case: 0603 (1608 Metric); Supplier Device Package: 0603; Size / Dimension: 0.063" L x 0.031" W (1.60mm x 0.80mm); Height: 0.022" (0.55mm); Number of Terminations: 2; ComponentLink1URL: http://www.yageo.com/documents/recent/PYu-RC_Group_51_RoHS_L_04.pdf; ComponentLink1Description: http://www.yageo.com/documents/recent/PYu-RC_Group_51_RoHS_L_04.pdf
R3 = MCD-00220: Resistor,10K,0603,1%,1/10W; Manufacturer_Part_Number: RC0603FR-0710KL; Manufacturer: YAGEO; Provided_By: Subcon; Initial_Board_Reference: MB1319; Internal_Part_Number: MCD-00220; ECCN_US: n/a; ECCN_EU: n/a; ComponentLink1Description: Yageo_Resistor_RC0603-series.pdf; Status: Released; Part_Type: Resistor; Package: R0603; ComponentLink1URL: http://tunmcdsvn.tun.st.com/Component_Datasheet_Library/Trunk/Resistors/Yageo_Resistor_RC0603-series
SB1 = MCD-00071: Solder Bridge ON; Part_Type: Mechanical; Manufacturer_Part_Number: RC0603JR-070RL; Manufacturer: YAGEO; Provided_By: SUBCO; Internal_Part_Number: MCD-00071; ECCN_US: n/a; ECCN_EU: n/a; Status: Released; Package: SB0603; ComponentLink1Description: Datasheet; ComponentLink1URL: http://tunmcdsvn.tun.st.com/Component_Datasheet_Library/Trunk/Resistors/Yageo_Resistor_RC0603-series
SW1 = TS-1088-AR02016: Manufacturer: XUNPU(讯普); Add into BOM: yes; Circuit: 单刀单掷; Actuator Style: 圆形按钮; Operating Force: 160gf; Switch Length: 4mm; Switch Width: 3mm; Switch Height: 2mm; Strike Gundam: 不带; Contact Current: 50mA; Voltage Rating (DC): 12V; Insulation Resistance: 100MΩ; Actuator/Cap Color: 黑色; Pin Style: SMD接片; Mechanical Life: 10万次; Symbol: TS-1088-AR02016; Device: TS-1088-AR02016; LCSC Part Name: 4*3*2mm 立贴 轻触开关; Supplier Part: C720477; Manufacturer Part: TS-1088-AR02016; Supplier Footprint: SMD; JLCPCB Part Class: Extended Part; Datasheet: https://atta.szlcsc.com/upload/public/pdf/source/20200810/C720475_60D09DD6C54279ADDB2DC25100F1CC11.pdf; Supplier: LCSC; Convert to PCB: yes; Mounting Style: 立贴; Operating Temperature: -30℃~+80℃
U1 = MCD-00136: Dual Transil array for ESD protection; Part_Type: Diode; Manufacturer: STMICROELECTRONICS; ECCN_US: EAR99; ECCN_EU: NEC; Provided_By: Subcon; Initial_Board_Reference: MB1262; Internal_Part_Number: MCD-00136; Status: Released; Manufacturer_Part_Number: ESDALC6V1W5; ComponentLink1Description: STM_ESD_ESDALC6V1W5.pdf; ComponentLink1URL: http://tunmcdsvn.tun.st.com/Component_Datasheet_Library/Trunk/Diodes/STM_ESD_ESDALC6V1W5
U2 = SN65HVD232D: Manufacturer: Texas Instruments; Protocol: CAN; Number of Drivers/Receivers: 1/1; Duplex: Half; Data Rate: 1Mbps; Voltage - Supply: 3 V ~ 3.6 V; Supplier 1: Digi-Key; Supplier Part Number 1: 296-26344-2-ND; RoHS: RoHS Compliant; Category: Integrated Circuits (ICs); Stock: 5000; Pricing 1: 2500=0.84375 (USD); Packaging: Tape & Reel (TR); Part Status: Active; Type: Transceiver; Operating Temperature: -40°C ~ 85°C; Mounting Type: Surface Mount; Package / Case: 8-SOIC (0.154", 3.90mm Width); Supplier Device Package: 8-SOIC; ComponentLink1URL: http://www.ti.com/lit/ds/symlink/sn65hvd230.pdf; ComponentLink1Description: http://www.ti.com/lit/ds/symlink/sn65hvd230.pdf; Supplier 2: Digi-Key; Supplier Part Number 2: 296-26344-1-ND; Pricing 2: 1=2.05, 10=1.842, 100=1.4809, 500=1.21668, 1000=1.00811 (USD); Manufacturer Part Number: CA-IF1051
U3 = WAFER-GH1.25-6PWB: Manufacturer: XUNPU(讯普); Add into BOM: yes; Pins Structure: 1x6P; Pitch: 1.25mm; Reference Series: GH; Number of PINs Per Row: 6; Current Rating (Max): 1A; Symbol: WAFER-GH1.25-6PWB; Device: WAFER-GH1.25-6PWB; LCSC Part Name: 1x6P 间距:1.25mm 卧贴 系列:GH; Supplier Part: C3029381; Manufacturer Part: WAFER-GH1.25-6PWB; Supplier Footprint: SMD,P=1.25mm,卧贴; JLCPCB Part Class: Extended Part; Datasheet: https://atta.szlcsc.com/upload/public/pdf/source/20220527/CB8773BFB0913C3B8ABD62CB38BA101A.pdf; Supplier: LCSC; Convert to PCB: yes; Mounting Style: 卧贴; Number of Pins: 6P; Number of Rows: 1; Operating Temperature Range: -25℃~+85℃
U4 = MCD-01243: STM32G474, LQFP64 package,  3D IC footprint with 2D socket footprint.; Manufacturer: STMICROELECTRONICS; BMS_Part_Number: 9175326; Provided_By: SUBCO with ST control; ECCN_US: 3A991A2; ECCN_EU: NEC; Internal_Part_Number: MCD-01243; Status: Checked; Part_Type: IC; Manufacturer_Part_Number: STM32G474RET6; Package: LQFP64; ComponentLink1Description: Datasheet; ComponentLink1URL: http://tunmcdsvn.tun.st.com/Component_Datasheet_Library/Trunk/IC/STM_MCU_STM32G4xx
U5 = WAFER-GH1.25-4PWB: Manufacturer: XUNPU(讯普); Add into BOM: yes; Pins Structure: 1x4P; Pitch: 1.25mm; Reference Series: GH; Number of PINs Per Row: 4; Current Rating (Max): 1A; Symbol: WAFER-GH1.25-4PWB; Device: WAFER-GH1.25-4PWB; LCSC Part Name: 1x4P 间距:1.25mm 卧贴 系列:GH; Supplier Part: C3029379; Manufacturer Part: WAFER-GH1.25-4PWB; Supplier Footprint: SMD,P=1.25mm,卧贴; JLCPCB Part Class: Extended Part; Datasheet: https://atta.szlcsc.com/upload/public/pdf/source/20220527/CB8773BFB0913C3B8ABD62CB38BA101A.pdf; Supplier: LCSC; Convert to PCB: yes; Mounting Style: 卧贴; Number of Pins: 4P; Number of Rows: 1; Operating Temperature Range: -25℃~+85℃
U6 = MCD-00170: ESD protection 6V1; Part_Type: Diode; Manufacturer: STMICROELECTRONICS; ECCN_US: EAR99; ECCN_EU: NEC; Provided_By: Subcon; Initial_Board_Reference: MB1274; Internal_Part_Number: MCD-00170; Status: Released; Manufacturer_Part_Number: ESDALC6V1-1U2; ComponentLink1Description: STM_ESD_ESDALC6V1-1U2.pdf; ComponentLink1URL: http://tunmcdsvn.tun.st.com/Component_Datasheet_Library/Trunk/Diodes/STM_ESD_ESDALC6V1-1U2
X1 = MCD-00091: Crystal 32.768kHz, 6pF, +-20ppm, 50Kohms max, SMD; Manufacturer_Part_Number: NX3215SA 32.768KHz EXS00A-MU00525; Manufacturer: NDK; Part_Type: Crystal_Osc; BMS_Part_Number: 9157034; ECCN_US: EAR99; ECCN_EU: NEC; Provided_By: SUBCO; Internal_Part_Number: MCD-00091; ComponentLink1Description: Datasheet; Status: Released; ComponentLink1URL: http://tunmcdsvn.tun.st.com/Component_Datasheet_Library/Trunk/Crystal_Osc/NDK_Crystal-For-ST_NX3215SA 32.768KHz EXS00A-MU00525 (EXS10B-21238); Order_Code_Digikey: 644-1386
X2 = MCD-01036: Crystal 24MHz, 6pF, +-20ppm, 80ohms max, SMD; Part_Type: Crystal_Osc; Manufacturer_Part_Number: NX2016SA 24MHz EXS00A-CS10820; Manufacturer: NDK; BMS_Part_Number: 9157045; ECCN_US: EAR99; ECCN_EU: NEC; Provided_By: SUBCO; Internal_Part_Number: MCD-01036; Status: Released; Package: (2016) 2.0 x 1.6 x 0.45 mm; ComponentLink1Description: Datasheet; ComponentLink1URL: http://tunmcdsvn.tun.st.com/Component_Datasheet_Library/Trunk/Crystal_Osc/NDK_NX2016SA 24MHz EXS00A-CS10820 (EXS10B-27366B); Order_Code_Digikey: 644-1365

## Sheet STM32G4_microcontroller_Power.SchDoc
size 420 x 297 mm; SheetNumber: 4; SheetTotal: 9
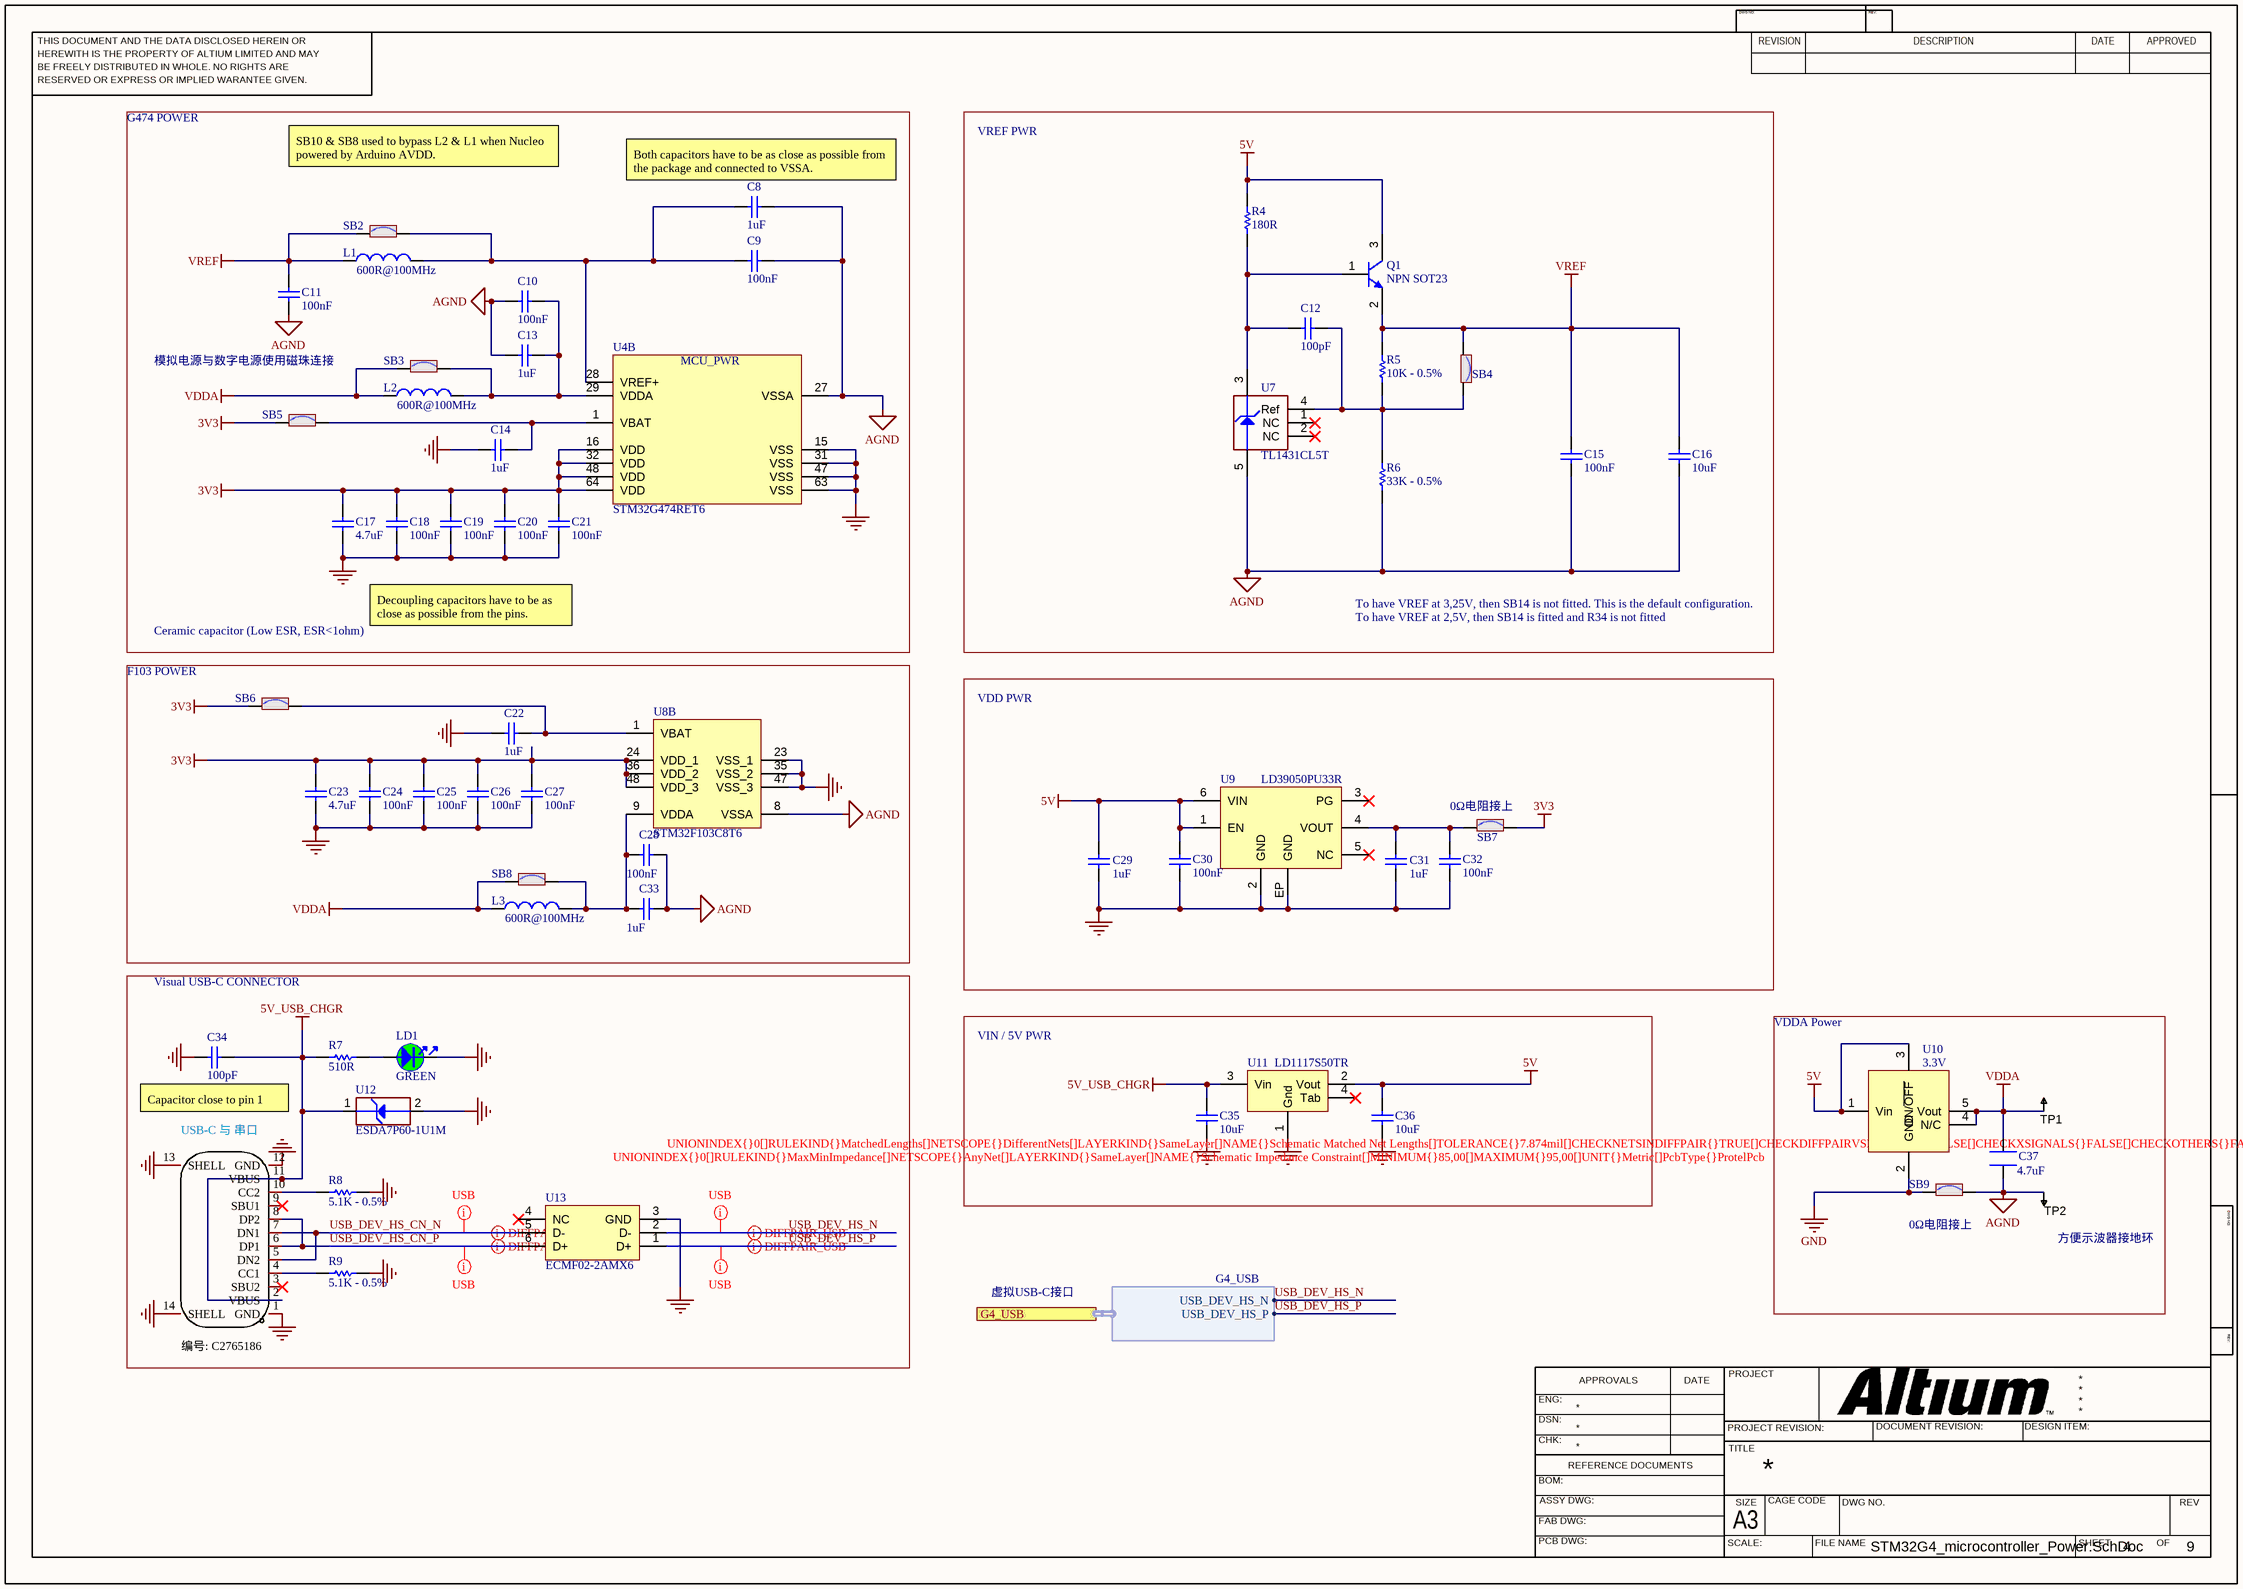
[diagram p3: STM32G4_microcontroller_Power.SchDoc]

### Parts
C8  value 1uF  [C0603]
C9  value 100nF  [C0402]
C10  value 100nF  [C0402]
C11  value 100nF  [C0402]
C12  value 100pF  [C0603]
C13  value 1uF  [C0603]
C14  value 1uF  [C0603]
C15  value 100nF  [C0603]
C16  value 10uF  [C0603]
C17  value 4.7uF  [C0603]
C18  value 100nF  [C0402]
C19  value 100nF  [C0402]
C20  value 100nF  [C0402]
C21  value 100nF  [C0402]
C22  value 1uF  [C0603]
C23  value 4.7uF  [C0603]
C24  value 100nF  [C0402]
C25  value 100nF  [C0402]
C26  value 100nF  [C0402]
C27  value 100nF  [C0402]
C28  value 100nF  [C0402]
C29  value 1uF  [C0603]
C30  value 100nF  [C0402]
C31  value 1uF  [C0603]
C32  value 100nF  [C0402]
C33  value 1uF  [C0603]
C34  value 100pF  [C0402]
C35  value 10uF  [C0805]
C36  value 10uF  [C0805]
C37  4.7uF  [CAPC2012X09N]
L1  value 600R@100MHz  [L0603]
L2  value 600R@100MHz  [L0603]
L3  value 600R@100MHz  [L0603]
LD1  value GREEN  [LED_0603_GREEN]
Q1  value NPN SOT23  [NPN_SOT23]
R4  value 180R  [R0603]
R5  value 10K - 0.5%  [R0603]
R6  value 33K - 0.5%  [R0603]
R7  value 510R  [R0603]
R8  value 5.1K - 0.5%  [R0603]
R9  value 5.1K - 0.5%  [R0603]
SB2  (no value)  [SOLDER-BRIDGE_R0603-0R]
SB3  (no value)  [SOLDER-BRIDGE_R0603-0R]
SB4  (no value)  [SOLDER-BRIDGE_R0603-0R]
SB5  (no value)  [SOLDER-BRIDGE_R0603-0R]
SB6  (no value)  [SOLDER-BRIDGE_R0603-0R]
SB7  (no value)  [SOLDER-BRIDGE_R0603-0R]
SB8  (no value)  [SOLDER-BRIDGE_R0603-0R]
SB9  (no value)  [SOLDER-BRIDGE_R0603-0R]
TP1  TESTPOINT  [TP-R30]  (value not drawn)  (no BOM)
TP2  TESTPOINT  [TP-R30]  (value not drawn)  (no BOM)
U4  value STM32G474RET6  [ICC_LQFP64_10X10_P050_SOCKET_YAMAICHI_IC149-064-069-B5_NM]  (part B of 2)
U7  value TL1431CL5T  [ICC_SOT23-5L_H1P45]
U8  STM32F103C8T6  [STM-LQFP48_L]  (part B of 2)
U9  value LD39050PU33R  [ICC_DFN6-EPAD_3X3_P095]
U10  3.3V  [SOT23-5]
U11  value LD1117S50TR  [REG_SOT223-TAB]
U12  value ESDA7P60-1U1M  [ESD_QFN2_1P6X1_P125]
U13  value ECMF02-2AMX6  [ESD_QFN-6L_1P7X1P5_P050]  (hidden comment: ​)
USB1  TYPE-C 16PIN 2MD(073)  [USB-C-SMD_TYPE-C-6PIN-2MD-073]  (value not drawn)

### Blocks framed on the sheet
VREF PWR: C12 C15 C16 Q1 R4-R6 SB4 U7
F103 POWER: C22-C28 C33 L3 SB6 SB8 U8
VIN / 5V PWR: C35 C36 U11

### Ports
G4_USB (harness G4_USB, see STM32G4_DRV8301_hardware_TOP_V1.0[2D], STM32G4_microcontroller[1B])

### Harnesses
G4_USB: USB_DEV_HS_N, USB_DEV_HS_P

### Nets
3V3: C17.2 C18.2 C19.2 C20.2 C21.2 C23.2 C24.2 C25.2 C26.2 C27.2 SB5.1 SB6.1 SB7.2 U4.16(VDD) U4.32(VDD) U4.48(VDD) U4.64(VDD) U8.24(VDD_1) U8.36(VDD_2) U8.48(VDD_3)
5V: C29.2 C30.2 C36.2 Q1.3(C) R4.2 U9.1(EN) U9.6(VIN) U10.1(Vin) U10.3(ON/~{OFF}) U11.2(Vout)
5V_USB_CHGR: C34.2 C35.2 R7.2 U11.3(Vin) U12.1(IO1) USB1.2(VBUS) USB1.11(VBUS)
AGND: C8.2 C9.2 C10.1 C11.1 C13.1 C15.1 C16.1 C28.1 C33.1 C37.1 R6.1 SB9.2 TP2.1 U4.27(VSSA) U7.5(Anode) U8.8(VSSA)
GND: C14.1 C17.1 C18.1 C19.1 C20.1 C21.1 C22.1 C23.1 C24.1 C25.1 C26.1 C27.1 C29.1 C30.1 C31.1 C32.1 C34.1 C35.1 C36.1 LD1.2 R8.1 R9.1 SB9.1 U4.15(VSS) U4.31(VSS) U4.47(VSS) U4.63(VSS) U8.23(VSS_1) U8.35(VSS_2) U8.47(VSS_3) U9.2(GND) U9.EP(GND) U10.2(GND) U11.1(Gnd) U12.2(GND) U13.3(GND) USB1.1(GND) USB1.12(GND) USB1.13(SHELL) USB1.14(SHELL)
VDDA: C37.2 L2.1 L3.1 SB3.1 SB8.1 TP1.1 U10.4(N/C) U10.5(Vout)
VREF: C11.2 C15.2 C16.2 L1.1 Q1.2(E) R5.2 SB2.1 SB4.1
USB_DEV_HS_CN_N: U13.5(D-) USB1.5(DN2) USB1.7(DN1)
USB_DEV_HS_CN_P: U13.6(D+) USB1.6(DP1) USB1.8(DP2)
USB_DEV_HS_N: U13.2(D-) ; port G4_USB.USB_DEV_HS_N
USB_DEV_HS_P: U13.1(D+) ; port G4_USB.USB_DEV_HS_P
NetC8_1: C8.1 C9.1 L1.2 SB2.2 U4.28(VREF+)
NetC10_2: C10.2 C13.2 L2.2 SB3.2 U4.29(VDDA)
NetC12_1: C12.1 Q1.1(B) R4.1 U7.3(Cathode)
NetC12_2: C12.2 R5.1 R6.2 SB4.2 U7.4(Ref)
NetC14_2: C14.2 SB5.2 U4.1(VBAT)
NetC22_2: C22.2 SB6.2 U8.1(VBAT)
NetC28_2: C28.2 C33.2 L3.2 SB8.2 U8.9(VDDA)
NetC31_2: C31.2 C32.2 SB7.1 U9.4(VOUT)
NetLD1_1: LD1.1 R7.1
NetR8_2: R8.2 USB1.10(CC2)
NetR9_2: R9.2 USB1.4(CC1)

Not connected (* = marked no-connect by the designer): U7 1(NC)* 2(NC)*; U9 3(PG)* 5(NC)*; U11 4(Tab)*; U13 4(NC)*; USB1 3(SBU2)* 9(SBU1)*

### Layout directives
differential pair; rule Impedance Constraint [Min = 85.00    Max = 95.00    ]: USB_DEV_HS_CN_N, USB_DEV_HS_CN_P, USB_DEV_HS_N, USB_DEV_HS_P
rule Undefined; rule Matched Net Lengths [Tolerance = 0.2mm]; rule Impedance Constraint [Min = 85.00    Max = 95.00    ]: USB_DEV_HS_CN_N, USB_DEV_HS_CN_P, USB_DEV_HS_N, USB_DEV_HS_P

### Notes on the sheet
- G474 POWER
- SB10 & SB8 used to bypass L2 & L1 when Nucleo powered by Arduino AVDD.
- (near C8) Both capacitors have to be as close as possible from the package and connected to VSSA.
- 模拟电源与数字电源使用磁珠连接
- Ceramic capacitor (Low ESR, ESR<1ohm)
- Decoupling capacitors have to be as close as possible from the pins.
- To have VREF at 3,25V, then SB14 is not fitted. This is the default configuration.
- To have VREF at 2,5V, then SB14 is fitted and R34 is not fitted
- VDD PWR
- (near SB7) 0Ω电阻接上
- Visual USB-C CONNECTOR
- (near U10) VDDA Power
- (near C34) Capacitor close to pin 1
- (near USB1) USB-C 与 串口
- (near SB9) 0Ω电阻接上
- (near TP2) 方便示波器接地环
- 虚拟USB-C接口
- (near USB1) 编号: C2765186
- THIS DOCUMENT AND THE DATA DISCLOSED HEREIN OR
- HEREWITH IS THE PROPERTY OF ALTIUM LIMITED AND MAY
- DWG NO:
- REVISION
- REV:
- DESCRIPTION
- DATE
- APPROVED
- BE FREELY DISTRIBUTED IN WHOLE. NO RIGHTS ARE
- RESERVED OR EXPRESS OR IMPLIED WARANTEE GIVEN.
- ENG:
- APPROVALS
- PROJECT
- DSN:
- CHK:
- REFERENCE DOCUMENTS
- PROJECT REVISION:
- TITLE
- DOCUMENT REVISION:
- DESIGN ITEM:
- BOM:
- FAB DWG:
- PCB DWG:
- ASSY DWG:
- SCALE:
- A3
- SIZE
- CAGE CODE
- FILE NAME
- DWG NO.
- SHEET
- OF
- REV
- (in symbol MCD-01243, part B) MCU_PWR

### Library data of the parts
C8 C13 C14 C22 C29 C31 C33 = MCD-00010: Capacitor, MLCC, 1uF, 16V, X5R, 10%, 0603, T=0,8mm; Manufacturer_Part_Number: CC0603KRX5R7BB105; Manufacturer: YAGEO; Provided_By: Subcon; Initial_Board_Reference: MB1274; Internal_Part_Number: MCD-00010; Status: Released; Package: C0603; ComponentLink1Description: Yageo_Capacitor_X5R-series.pdf; ECCN_US: n/a; ECCN_EU: n/a; Part_Type: Capacitor; ComponentLink1URL: http://tunmcdsvn.tun.st.com/Component_Datasheet_Library/Trunk/Capacitors/Yageo_Multilayer_capacitor_X5R_series_100pF_to_100uF
C9-C11 C18-C21 C24-C28 C30 C32 = MCD-00102: as C6 on sheet STM32G4_microcontroller; Internal_Part_Number: MCD-00102; Status: Released; Package: C0402; ComponentLink1Description: Yageo_Capacitor_X7R-series.pdf; ECCN_US: n/a; ECCN_EU: n/a; Part_Type: Capacitor; ComponentLink1URL: http://tunmcdsvn.tun.st.com/Component_Datasheet_Library/Trunk/Capacitors/Yageo_Multilayer_Capacitor_X7R_series_100pF_to_22uF
C12 = MCD-01101: Capacitor,100pF,50V,X7R,10%,0603; Manufacturer_Part_Number: 06035C101JAT4A; Manufacturer: AVX; ECCN_US: EAR99; ECCN_EU: NEC; Provided_By: SUBCO; Internal_Part_Number: MCD-01101; Status: Checked; Part_Type: Capacitor; Package: C0603; ComponentLink1Description: Datasheet; ComponentLink1URL: http://tunmcdsvn.tun.st.com/Component_Datasheet_Library/Trunk/Capacitors/AVX_Capacitor_X7R-series/AVX_X7R-series.pdf; Alternate_Manufacturer_Part_Number: N/A; Alternate_Manufacturer: N/A; Order_Code_Digikey: 06035C101JAT4A-ND; Order_Code_Farnell: N/A; Order_Code_RS: N/A; BMS_Part_Number: N/A
C15 = MCD-00211: Capacitor, MLCC, 100nF, 16V, X7R, 10%, 0603, T=0,8mm; Manufacturer_Part_Number: CC0603KRX7R7BB104; Manufacturer: YAGEO; ECCN_US: EAR99; ECCN_EU: NEC; Provided_By: SUBCO; Internal_Part_Number: MCD-00211; Status: Released; Part_Type: Capacitor; Package: C0603; ComponentLink1Description: Datasheet; ComponentLink1URL: http://tunmcdsvn.tun.st.com/Component_Datasheet_Library/Trunk/Capacitors/Yageo_Multilayer_Capacitor_X7R_series_100pF_to_22uF
C16 = MCD-01124: Capacitor, MLCC, 10uF, 10V, X5R, 10%, 0603, T=0.8mm; Manufacturer_Part_Number: GRM188R61A106KAAL; Manufacturer: MURATA; ECCN_US: EAR99; ECCN_EU: NEC; Provided_By: SUBCO; Internal_Part_Number: MCD-01124; Status: Released; Part_Type: Capacitor; Package: C0603; ComponentLink1Description: Datasheet; ComponentLink1URL: http://tunmcdsvn.tun.st.com/Component_Datasheet_Library/Trunk/Capacitors/Murata_Capacitor_GR_series
C17 C23 = MCD-00009: Capacitor, MLCC, 4.7uF, 16V, X5R, 10%, 0603, T=0.8mm; Manufacturer_Part_Number: CC0603KRX5R7BB475; Manufacturer: YAGEO; Provided_By: subcon; Initial_Board_Reference: MB1274; Internal_Part_Number: MCD-00009; ComponentLink1Description: Yageo_Capacitor_X5R-series.pdf; ECCN_US: n/a; ECCN_EU: n/a; Status: Released; Part_Type: Capacitor; Package: C0603; ComponentLink1URL: http://tunmcdsvn.tun.st.com/Component_Datasheet_Library/Trunk/Capacitors/Yageo_Multilayer_capacitor_X5R_series_100pF_to_100uF
C34 = MCD-00205: Capacitor, MLCC, 100pF, 50V, NPO, 5%, 0402, T=0,5mm; Manufacturer_Part_Number: CC0402JRNPO9BN101; Manufacturer: YAGEO; Provided_By: Subcon; Internal_Part_Number: MCD-00205; Status: Footprint available; Part_Type: Capacitor; Package: C0402; ComponentLink1Description: Yageo_Capacitor_NP0_16V-to-50V.pdf; ComponentLink1URL: http://tunmcdsvn.tun.st.com/Component_Datasheet_Library/Trunk/Capacitors/Yageo_Capacitor_NP0_16V-to-50V
C35 C36 = MCD-00014: Capacitor, MLCC, 10uF, 25V, X5R, 10%, 0805, T=0,85mm; Manufacturer_Part_Number: CC0805KRX5R8BB106; Manufacturer: YAGEO; ECCN_US: EAR99; ECCN_EU: NEC; Provided_By: SUBCO; Internal_Part_Number: MCD-00014; ComponentLink1Description: Datasheet; Status: Released; Part_Type: Capacitor; Package: C0805; ComponentLink1URL: http://tunmcdsvn.tun.st.com/Component_Datasheet_Library/Trunk/Capacitors/Yageo_Multilayer_capacitor_X5R_series_100pF_to_100uF
C37 = GRM219R6YA475KA73D: CAP CER 4.7UF 35V X5R 0805; Manufacturer: Murata Electronics North America; Tolerance: ±10%; Supplier 1: Digi-Key; Supplier Part Number 1: 490-7208-2-ND; RoHS: RoHS Compliant; Category: Capacitors; Pricing 1: 4000=0.05126, 8000=0.0487, 12000=0.04613 (USD); Packaging: Tape & Reel (TR); Part Status: Active; Voltage - Rated: 35V; Temperature Coefficient: X5R; Operating Temperature: -55°C ~ 85°C; Features: Derating Recommended; Ratings: -; Applications: General Purpose; Mounting Type: Surface Mount, MLCC; Package / Case: 0805 (2012 Metric); Size / Dimension: 0.079" L x 0.049" W (2.01mm x 1.25mm); Height - Seated (Max): -; Thickness (Max): 0.037" (0.95mm); Lead Spacing: -; Lead Style: -; ComponentLink1URL: http://www.murata.com/~/media/webrenewal/support/library/catalog/products/capacitor/mlcc/c02e.ashx?la=en-us; ComponentLink1Description: http://www.murata.com/~/media/webrenewal/support/library/catalog/products/capacitor/mlcc/c02e.ashx?la=en-us; Supplier 2: Digi-Key; Supplier Part Number 2: 490-7208-1-ND; Pricing 2: 1=0.26, 10=0.177, 100=0.1002, 500=0.07076, 1000=0.06191 (USD); Value: 4.7uF; Stock: 152000; Manufacturer Part Number: GRM219R6YA475KA73D
L1-L3 = MCD-00047: SMD Chip ferrite bead, 600R@100MHz +/-25%, 350mA, 500mohm DC, 0603, T=0.8mm; Part_Type: Inductor; Manufacturer_Part_Number: FCM1608KF-601T03; Manufacturer: TAI-TECH; Provided_By: SUBCO; Internal_Part_Number: MCD-00047; Status: Released; ComponentLink1Description: Datasheet; ComponentLink1URL: http://tunmcdsvn.tun.st.com/Component_Datasheet_Library/Trunk/Inductors/TaiTech_Bead_FCM1608_series; ECCN_US: n/a; ECCN_EU: n/a
LD1 = MCD-00050: LED, Green, 0603; Manufacturer_Part_Number: 19-213SYGC/S530-E2/TR8; Manufacturer: EVERLIGHT; Part_Type: Display; ECCN_US: EAR99; ECCN_EU: NEC; Provided_By: SUBCO; Internal_Part_Number: MCD-00050; ComponentLink1Description: Datasheet; Status: Released; ComponentLink1URL: http://tunmcdsvn.tun.st.com/Component_Datasheet_Library/Trunk/Display/Everlight_SMD-LED-GREEN_19-213SYGC-S530-XX-TR8-v3.doc; Package: LED 0603
Q1 = MCD-00073: NPN Bipolar Transistor; Part_Type: IC; Manufacturer_Part_Number: BSR14; Manufacturer: ON SEMICONDUCTOR; Alternate_Manufacturer_Part_Number: MMBT2222LT1G / MMBT2222ALT1G / MMBT2222ALT3G; ECCN_US: EAR99; ECCN_EU: NEC; Provided_By: SUBCO; Revision: *; Internal_Part_Number: MCD-00073; Status: Released; ComponentLink1Description: Datasheet; ComponentLink1URL: http://tunmcdsvn.tun.st.com/Component_Datasheet_Library/Trunk/IC/NXP_Transistor_BSR14; Alternate_Manufacturer: ON SEMICONDUCTOR; Package: SOT23
R4 = MCD-00342: Resistor,180R,0603,1%,1/10W; Manufacturer_Part_Number: RC0603FR-07180RL; Manufacturer: YAGEO; ECCN_US: EAR99; ECCN_EU: NEC; Provided_By: SUBCO; Internal_Part_Number: MCD-00342; Status: Released; Part_Type: Resistor; Package: R0603; ComponentLink1Description: Datasheet; ComponentLink1URL: http://tunmcdsvn.tun.st.com/Component_Datasheet_Library/Trunk/Resistors/Yageo_Resistor_RC0603-series
R5 = MCD-01215: resistor, 10K, 0603, 0.5%, 1/10W; Manufacturer_Part_Number: RC0603DR-0710KL; Manufacturer: YAGEO; ECCN_US: EAR99; ECCN_EU: NEC; Provided_By: SUBCO; Internal_Part_Number: MCD-01215; Status: Checked; Part_Type: Resistor; Package: R0603; ComponentLink1Description: Datasheet; ComponentLink1URL: http://tunmcdsvn.tun.st.com/Component_Datasheet_Library/Trunk/Resistors/Yageo_Resistor_RC0603-series/RC_Group_51_RoHS_L_7.pdf
R6 = MCD-01209: Resistor,33K,0603,0.5%,1/10W; Manufacturer_Part_Number: RC0603DR-0733KL; Manufacturer: YAGEO; ECCN_US: EAR99; ECCN_EU: NEC; Provided_By: SUBCO; Internal_Part_Number: MCD-01209; Status: Checked; Part_Type: Resistor; Package: R0603; ComponentLink1Description: Datasheet; ComponentLink1URL: http://tunmcdsvn.tun.st.com/Component_Datasheet_Library/Trunk/Resistors/Yageo_Resistor_RC0603-series/RC_Group_51_RoHS_L_7.pdf
R7 = MCD-00225: Resistor,510R,0603,1%,1/10W; Manufacturer_Part_Number: RC0603FR-07510RL; Manufacturer: YAGEO; ECCN_US: EAR99; ECCN_EU: NEC; Provided_By: SUBCO; Internal_Part_Number: MCD-00225; ComponentLink1Description: Datasheet; Status: Released; Part_Type: Resistor; Package: R0603; ComponentLink1URL: http://tunmcdsvn.tun.st.com/Component_Datasheet_Library/Trunk/Resistors/Yageo_Resistor_RC0603-series
R8 R9 = MCD-01209: Resistor,5.1K,0603,0.5%,1/10W; Manufacturer_Part_Number: RC0603DR-0733KL; Manufacturer: YAGEO; ECCN_US: EAR99; ECCN_EU: NEC; Provided_By: SUBCO; Internal_Part_Number: MCD-01209; Status: Checked; Part_Type: Resistor; Package: R0603; ComponentLink1Description: Datasheet; ComponentLink1URL: http://tunmcdsvn.tun.st.com/Component_Datasheet_Library/Trunk/Resistors/Yageo_Resistor_RC0603-series/RC_Group_51_RoHS_L_7.pdf
SB2-SB9 = MCD-00071: as SB1 on sheet STM32G4_microcontroller; Internal_Part_Number: MCD-00071; ECCN_US: n/a; ECCN_EU: n/a; Status: Released; Package: SB0603; ComponentLink1Description: Datasheet; ComponentLink1URL: http://tunmcdsvn.tun.st.com/Component_Datasheet_Library/Trunk/Resistors/Yageo_Resistor_RC0603-series
TP1 TP2 = TESTPOINT: SMD test pin
U4 = MCD-01243: as U4 on sheet STM32G4_microcontroller; Internal_Part_Number: MCD-01243; Status: Checked; Part_Type: IC; Manufacturer_Part_Number: STM32G474RET6; Package: LQFP64; ComponentLink1Description: Datasheet; ComponentLink1URL: http://tunmcdsvn.tun.st.com/Component_Datasheet_Library/Trunk/IC/STM_MCU_STM32G4xx
U7 = MCD-01802: Programmable voltage reference with 0.4% voltage precision; Part_Type: IC; Manufacturer: STMICROELECTRONICS; BMS_Part_Number: 9176334; ECCN_US: EAR99; ECCN_EU: NEC; Provided_By: SUBCO with ST control; Internal_Part_Number: MCD-01802; Status: Footprint available; Manufacturer_Part_Number: TL1431CL5T; Package: SOT23-5L; ComponentLink1Description: Datasheet; ComponentLink1URL: http://tunmcdsvn.tun.st.com/Component_Datasheet_Library/Trunk/IC/STM_voltage_reference_TL1431ACL5T/
U8 = CMP-0237-00215-3: ARM Cortex-M3 32-bit MCU, 64 KB Flash, 20 KB Internal RAM, 37 I/Os, 48-pin LQFP, -40 to 85 degC, Tray; Supply Voltage(Vcc) min (V): 2; Internal RAM Size (kB): 20; FLASH Size (Prog) (kB): 64; A/D Converter: 2x12-bit (10 Channel); I/Os (High Current): 37; Operating Frequency(F) (Processor speed) (MHz): 72; Core: ARM Cortex-M3; ComponentLink3Description: Package Specification; Mounting Technology: Surface Mount; PartNumber: STM32F103C8T6; PackageReference: LQFP48; Packing: Tray; ComponentLink3URL: http://www.st.com/st-web-ui/static/active/en/resource/technical/document/datasheet/DM00058181.pdf; DatasheetVersion: Rev. 16; ComponentLink1URL: http://www.st.com/web/en/home.html; PackageVersion: Rev. 6, 06/2013; ComponentLink2URL: http://www.st.com/st-web-ui/static/active/en/resource/technical/document/datasheet/CD00161566.pdf; ComponentLink1Description: Manufacturer URL; ComponentLink2Description: Datasheet; PackageDescription: 48-Pin Low Profile Quad Flat Package, 7 x 7 mm Body, 0.5 mm Pitch
U9 = MCD-00215: Low quiescent current and low noise voltage regulators; Manufacturer: STMICROELECTRONICS; Part_Type: IC; BMS_Part_Number: 9176126; ECCN_US: EAR99; ECCN_EU: NEC; Provided_By: SUBCO with ST control; Internal_Part_Number: MCD-00215; Manufacturer_Part_Number: LD39050PU33R; Status: Released; ComponentLink1Description: Datasheet; ComponentLink1URL: http://tunmcdsvn.tun.st.com/Component_Datasheet_Library/Trunk/IC/STM_LDO_LD39050PU; Package: DFN6 3x3mm
U10 = LP5907MFX-3.3/NOPB: IC REG LDO 3.3V 0.25A SOT23-5; Manufacturer: Texas Instruments; Regulator Topology: Positive Fixed; Current - Output: 250mA; Voltage - Input: Up to 5.5V; Supplier 1: Digi-Key; Supplier Part Number 1: 296-38557-1-ND; RoHS: RoHS Compliant; Category: Integrated Circuits (ICs); Stock 1: 39845; Pricing 1: 1=0.57, 10=0.487, 100=0.3634, 500=0.28552, 1000=0.22063 (USD); Packaging: Cut Tape (CT); Part Status: Active; Voltage - Output: 3.3V; Voltage - Dropout (Typical): -; Current - Limit (Min): -; Operating Temperature: -40°C ~ 125°C; Mounting Type: Surface Mount; Package / Case: SC-74A, SOT-753; Supplier Device Package: SOT-23; ComponentLink1URL: http://www.ti.com/lit/ds/symlink/lp5907.pdf; ComponentLink1Description: http://www.ti.com/lit/ds/symlink/lp5907.pdf
U11 = MCD-00088: IC REG LDO 5V 0.8A SOT223; Manufacturer: STMICROELECTRONICS; BMS_Part_Number: 9176133; ECCN_US: EAR99; ECCN_EU: NEC; Provided_By: SUBCO with ST control; Internal_Part_Number: MCD-00088; Manufacturer_Part_Number: LD1117S50TR; ComponentLink1Description: Datasheet; Status: Released; Part_Type: IC; ComponentLink1URL: http://tunmcdsvn.tun.st.com/Component_Datasheet_Library/Trunk/IC/STM_LDO_LD1117; Package: SOT-223
U12 = MCD-00251: High power transient voltage suppressor, 7V breakdown; Part_Type: IC; Manufacturer: STMICROELECTRONICS; ECCN_US: EAR99; ECCN_EU: NEC; Provided_By: Subcon; Initial_Board_Reference: MB1311; Internal_Part_Number: MCD-00251; Status: Released; Manufacturer_Part_Number: ESDA7P60-1U1M; ComponentLink1Description: STM_ESD_ESDA7P60-1U1M.pdf; ComponentLink1URL: http://tunmcdsvn.tun.st.com/Component_Datasheet_Library/Trunk/Diodes/STM_ESD_ESDA7P60-1U1M
U13 = MCD-00649: Common mode filter with ESD protection for USB 2.0 interface; Part_Type: Diode; Manufacturer: STMICROELECTRONICS; ECCN_US: EAR99; ECCN_EU: NEC; Provided_By: Subcon; Initial_Board_Reference: MB1248; Internal_Part_Number: MCD-00649; Status: Footprint available; Manufacturer_Part_Number: ECMF02-2AMX6; ComponentLink1Description: STM_ESD_ECMF02-2AMX6.pdf; ComponentLink1URL: http://tunmcdsvn.tun.st.com/Component_Datasheet_Library/Trunk/Diodes/STM_ESD_ECMF02-2AMX6
USB1 = TYPE-C 16PIN 2MD(073): Manufacturer: SHOU HAN(首韩); Add into BOM: yes; Gender: 母; Number of Ports: 1; Number of Contacts: 16P; Current Rating - Power (Max): 5A; Symbol: TYPE-C 16PIN 2MD(073); Device: TYPE-C 16PIN 2MD(073); LCSC Part Name: Type-C 母 卧贴; Supplier Part: C2765186; Manufacturer Part: TYPE-C 16PIN 2MD(073); Supplier Footprint: SMD; JLCPCB Part Class: Extended Part; Datasheet: https://atta.szlcsc.com/upload/public/pdf/source/20211123/39B17C16241EAC15C5E277BDA434118E.pdf; Supplier: LCSC; Convert to PCB: yes; Connector Type: Type-C; Standard: -; Mounting Style: 卧贴; Operating Temperature Range: -25℃~+85℃